# Altium project MB1219.PrjPCB (part 2 of 3)

## Sheet MotorControl.SchDoc: Motor Control
size A4; DocumentNumber: MB1219; Revision: B.1; SheetNumber: 13; SheetTotal: 17; Project: STM32F769I-EVAL
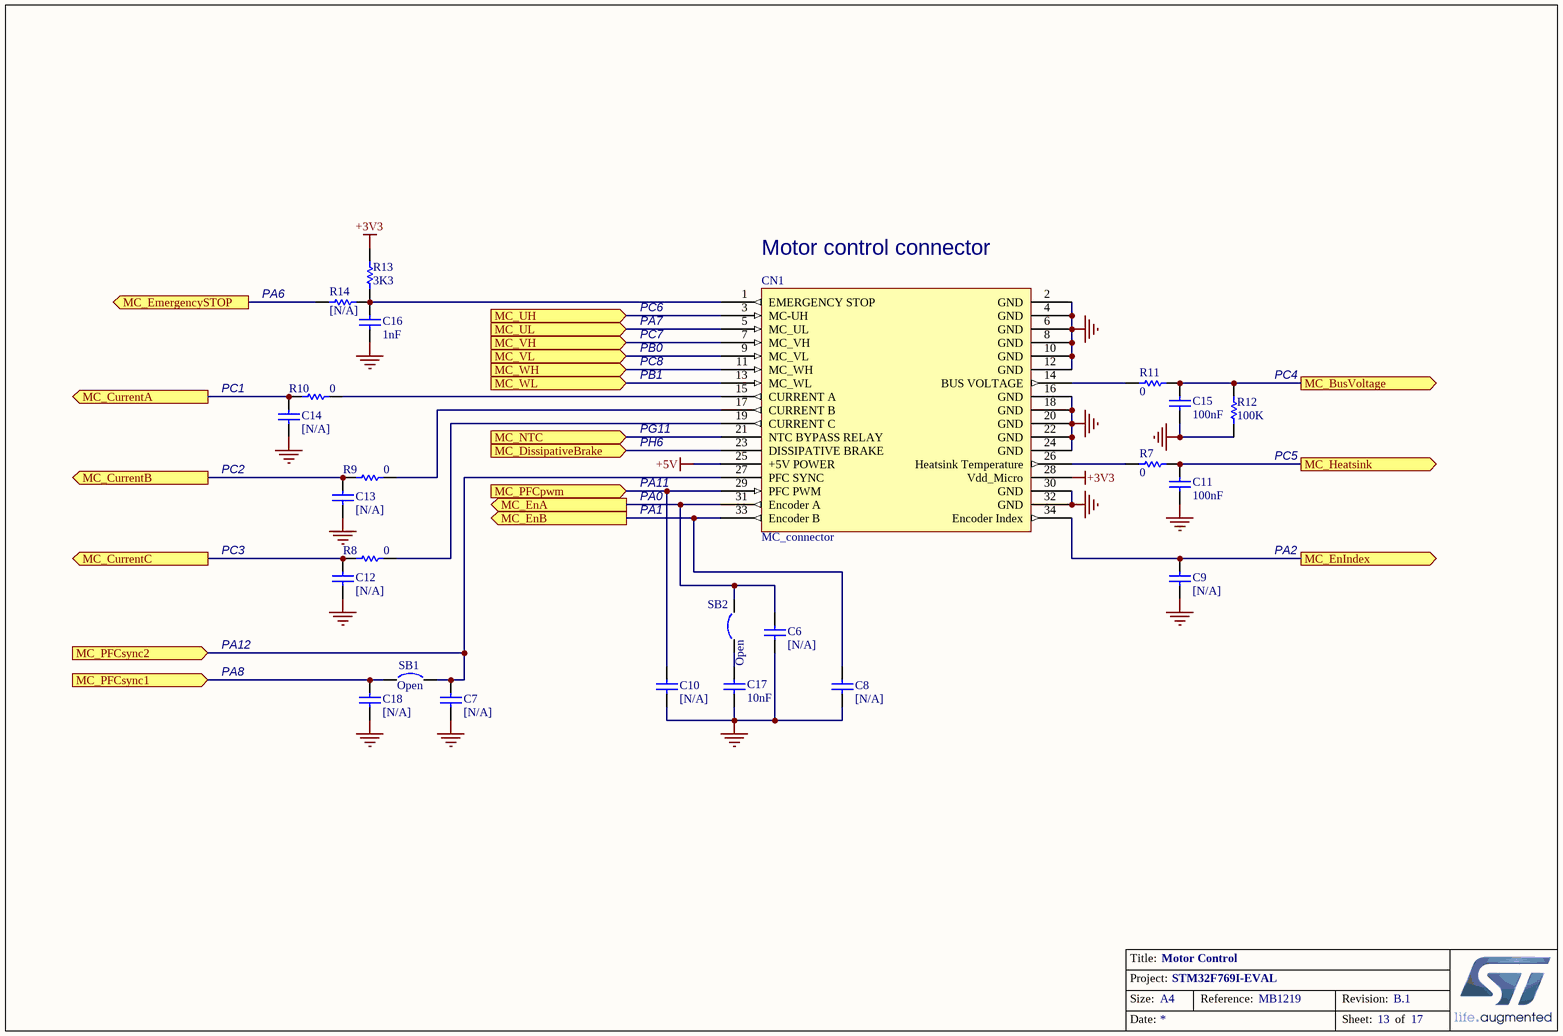
[diagram p7: MotorControl.SchDoc]

### Parts
C6  [N/A]  [0603C]
C7  [N/A]  [0603C]
C8  [N/A]  [0603C]
C9  [N/A]  [0603C]
C10  [N/A]  [0603C]
C11  100nF  [0603C]
C12  [N/A]  [0603C]
C13  [N/A]  [0603C]
C14  [N/A]  [0603C]
C15  100nF  [0603C]
C16  1nF  [0603C]
C17  10nF  [0603C]
C18  [N/A]  [0603C]
CN1  MC_connector  [IDC34S]
R7  0  [0603R]
R8  0  [0603R]
R9  0  [0603R]
R10  0  [0603R]
R11  0  [0603R]
R12  100K  [0603R]
R13  3K3  [0603R]
R14  [N/A]  [0603R]
SB1  Open  [SB_0603]
SB2  Open  [SB_0603]

### Ports
MC_BusVoltage (out), MC_CurrentA (out), MC_CurrentB (out), MC_CurrentC (out), MC_DissipativeBrake (in), MC_EmergencySTOP (out), MC_EnA (out), MC_EnB (out), MC_EnIndex (out), MC_Heatsink (out), MC_NTC (in), MC_PFCpwm (in), MC_PFCsync1 (in), MC_PFCsync2 (in), MC_UH (in), MC_UL (in), MC_VH (in), MC_VL (in), MC_WH (in), MC_WL (in)

### Nets
+3V3: CN1.28(Vdd_Micro) R13.2
+5V: CN1.25(+5V_POWER)
GND: C6.1 C7.1 C8.1 C9.1 C10.1 C11.2 C12.1 C13.1 C14.1 C15.2 C16.1 C17.2 C18.1 CN1.2(GND) CN1.4(GND) CN1.6(GND) CN1.8(GND) CN1.10(GND) CN1.12(GND) CN1.16(GND) CN1.18(GND) CN1.20(GND) CN1.22(GND) CN1.24(GND) CN1.30(GND) CN1.32(GND) R12.2
LCD_G2: R14.2 ; port MC_EmergencySTOP
PAR_D1: CN1.7(MC_VH) ; port MC_VH
NetC6_2: C6.2 CN1.31(Encoder_A) SB2.2 ; port MC_EnA
NetC7_2: C7.2 CN1.27(PFC_SYNC) SB1.2 ; port MC_PFCsync2
NetC8_2: C8.2 CN1.33(Encoder_B) ; port MC_EnB
NetC9_2: C9.2 CN1.34(Encoder_Index) ; port MC_EnIndex
NetC10_2: C10.2 CN1.29(PFC_PWM) ; port MC_PFCpwm
NetC11_1: C11.1 R7.2 ; port MC_Heatsink
NetC12_2: C12.2 R8.1 ; port MC_CurrentC
NetC13_2: C13.2 R9.1 ; port MC_CurrentB
NetC14_2: C14.2 R10.1 ; port MC_CurrentA
NetC15_1: C15.1 R11.2 R12.1 ; port MC_BusVoltage
NetC16_2: C16.2 CN1.1(EMERGENCY_STOP) R13.1 R14.1
NetC17_1: C17.1 SB2.1
NetC18_2: C18.2 SB1.1 ; port MC_PFCsync1
NetCN1_3: CN1.3(MC-UH) ; port MC_UH
NetCN1_5: CN1.5(MC_UL) ; port MC_UL
NetCN1_9: CN1.9(MC_VL) ; port MC_VL
NetCN1_11: CN1.11(MC_WH) ; port MC_WH
NetCN1_13: CN1.13(MC_WL) ; port MC_WL
NetCN1_14: CN1.14(BUS_VOLTAGE) R11.1
NetCN1_15: CN1.15(CURRENT_A) R10.2
NetCN1_17: CN1.17(CURRENT_B) R9.2
NetCN1_19: CN1.19(CURRENT_C) R8.2
NetCN1_21: CN1.21(NTC_BYPASS_RELAY) ; port MC_NTC
NetCN1_23: CN1.23(DISSIPATIVE_BRAKE) ; port MC_DissipativeBrake
NetCN1_26: CN1.26(Heatsink_Temperature) R7.1

### Notes on the sheet
- (near R14) PA6
- PC6
- (near CN1) Motor control connector
- PA7
- PB0
- PB1
- PC7
- PC8
- (near R12) PC4
- PC1
- PG11
- PH6
- PC2
- PA1
- PA0
- PA11
- (near R12) PC5
- PC3
- PA2
- PA12
- PA8
- Title:
- Project:
- Size:
- Date:
- A4
- Reference:
- Sheet:
- Revision:
- of

### Library data of the parts
C6-C10 C12-C14 C18 = cap: Capacitor; Value: 100pF; Published: 8-Jun-2000; Revision: July-2002: Re-released for DXP Platform.; Publisher: Altium Limited
C11 C15 = Cap: Capacitor; Value: 10nF; Published: 8-Jun-2000; Revision: July-2002: Re-released for DXP Platform.; Publisher: Altium Limited
C16 C17 = CAP: Capacitor; Value: 100pF; Published: 8-Jun-2000; Revision: July-2002: Re-released for DXP Platform.; Publisher: Altium Limited
R7-R11 R13 R14 = Res1: Resistor; Value: 1K; Published: 8-Jun-2000; Revision: July-2002: Re-released for DXP Platform.; Publisher: Altium Limited
R12 = res1: Resistor; Value: 1K; Published: 8-Jun-2000; Revision: July-2002: Re-released for DXP Platform.; Publisher: Altium Limited
SB1 SB2 = Circuit Breaker: Published: 24-Mar-1999; Revision: July-2002: Re-released for DXP Platform.; Publisher: Altium Limited

## Sheet Peripherals.SchDoc: Peripherals
size A4; DocumentNumber: MB1219; Revision: B.1; SheetNumber: 12; SheetTotal: 17; Project: STM32F769I-EVAL
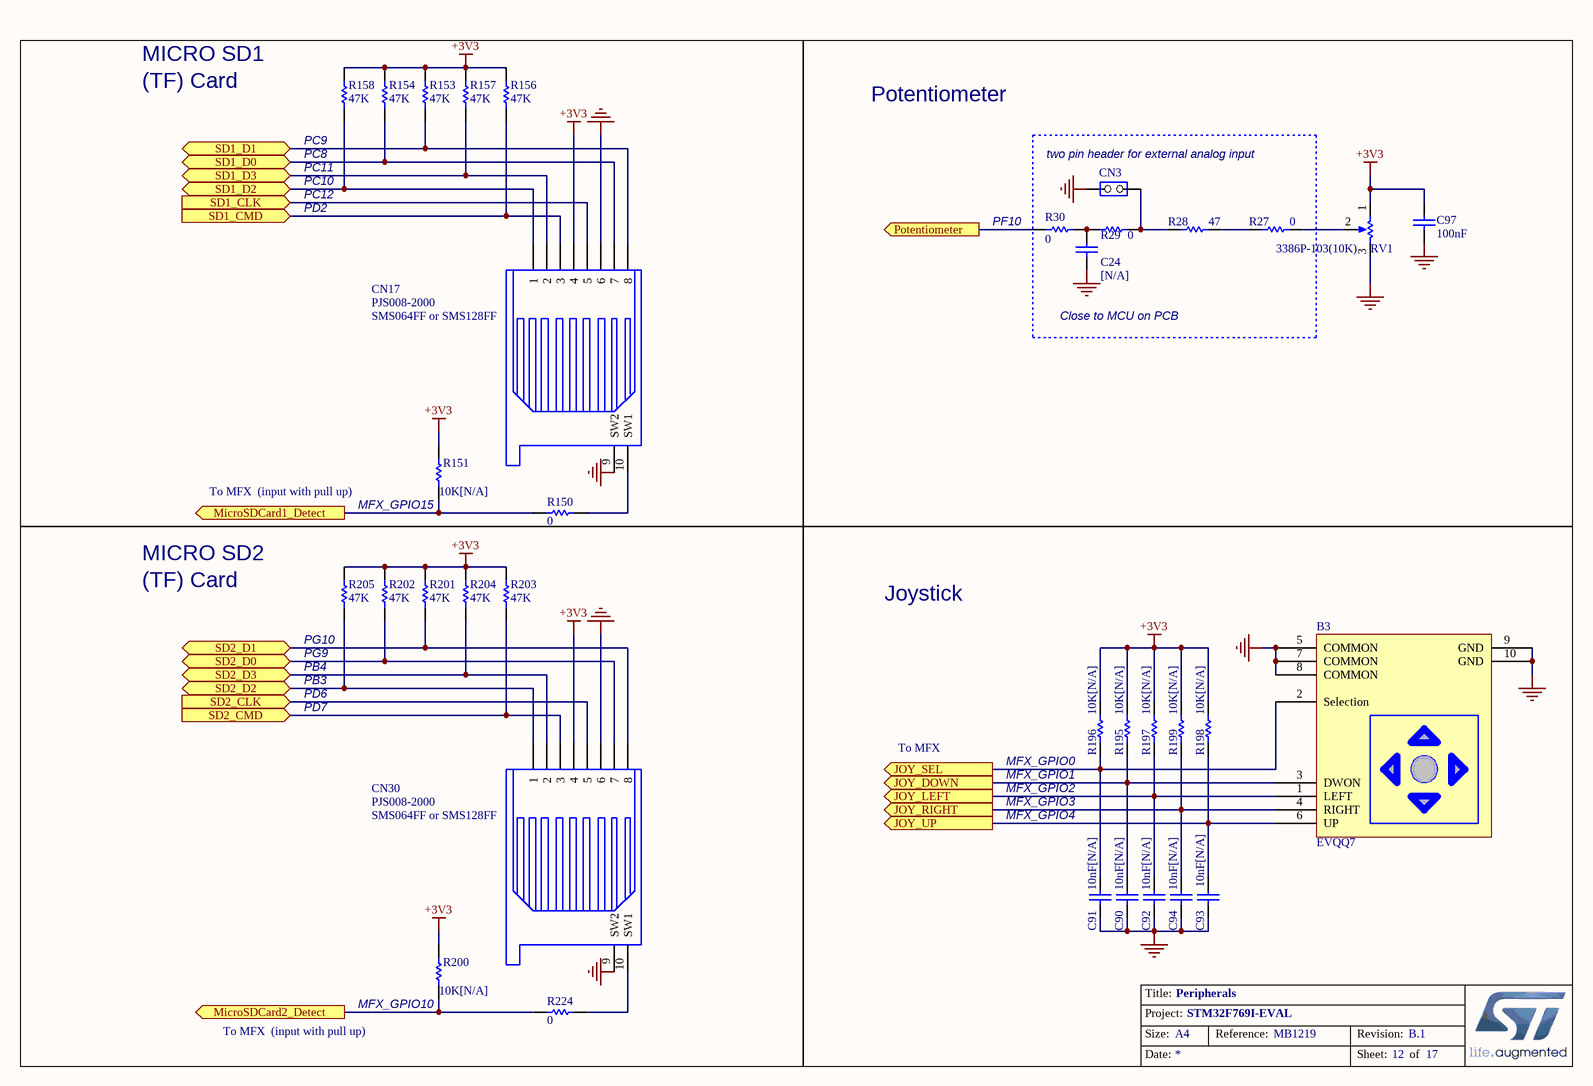
[diagram p8: Peripherals.SchDoc]

### Parts
B3  EVQQ7  [SW-JOY]
C24  [N/A]  [0603C]
C90  10nF[N/A]  [0603C]
C91  10nF[N/A]  [0603C]
C92  10nF[N/A]  [0603C]
C93  10nF[N/A]  [0603C]
C94  10nF[N/A]  [0603C]
C97  100nF  [0603C]
CN3  (no value)  [SIP2]
CN17  PJS008-2000  [MSD_PJS008_]
CN30  PJS008-2000  [MSD_PJS008_]
R27  0  [0603R]
R28  47  [0603R]
R29  0  [0603R]
R30  0  [0603R]
R150  0  [0603R]
R151  10K[N/A]  [0603R]
R153  47K  [0603R]
R154  47K  [0603R]
R156  47K  [0603R]
R157  47K  [0603R]
R158  47K  [0603R]
R195  10K[N/A]  [0603R]
R196  10K[N/A]  [0603R]
R197  10K[N/A]  [0603R]
R198  10K[N/A]  [0603R]
R199  10K[N/A]  [0603R]
R200  10K[N/A]  [0603R]
R201  47K  [0603R]
R202  47K  [0603R]
R203  47K  [0603R]
R204  47K  [0603R]
R205  47K  [0603R]
R224  0  [0603R]
RV1  3386P-103(10K)  [3386P]

### Ports
JOY_DOWN (out), JOY_LEFT (out), JOY_RIGHT (out), JOY_SEL (out), JOY_UP (out), MicroSDCard1_Detect (out), MicroSDCard2_Detect (out), Potentiometer (out), SD1_CLK (in), SD1_CMD (in), SD1_D0 (bidir), SD1_D1 (bidir), SD1_D2 (bidir), SD1_D3 (bidir), SD2_CLK (in), SD2_CMD (in), SD2_D0 (bidir), SD2_D1 (bidir), SD2_D2 (bidir), SD2_D3 (bidir)

### Nets
+3V3: C97.1 CN17.4 CN30.4 R151.2 R153.1 R154.1 R156.1 R157.1 R158.1 R195.1 R196.1 R197.1 R198.1 R199.1 R200.2 R201.1 R202.1 R203.1 R204.1 R205.1 RV1.1(BOT)
GND: B3.5(COMMON) B3.7(COMMON) B3.8(COMMON) B3.9(GND) B3.10(GND) C24.1 C90.1 C91.1 C92.1 C93.1 C94.1 C97.2 CN3.2(NO) CN17.6 CN17.9(SW2) CN30.6 CN30.9(SW2) RV1.3(TOP)
PAR_D9: CN17.5 ; port SD1_CLK
PB3: CN30.1 R205.2 ; port SD2_D2
PB4: CN30.2 R204.2 ; port SD2_D3
PD7: CN30.3 R203.2 ; port SD2_CMD
PF10: R30.2 ; port Potentiometer
PG9: CN30.7 R202.2 ; port SD2_D0
PG10: CN30.8 R201.2 ; port SD2_D1
NetB3_1: B3.1(LEFT) C92.2 R197.2 ; port JOY_LEFT
NetB3_2: B3.2(Selection) C91.2 R196.2 ; port JOY_SEL
NetB3_3: B3.3(DWON) C90.2 R195.2 ; port JOY_DOWN
NetB3_4: B3.4(RIGHT) C94.2 R199.2 ; port JOY_RIGHT
NetB3_6: B3.6(UP) C93.2 R198.2 ; port JOY_UP
NetC24_2: C24.2 R29.1 R30.1
NetCN3_1: CN3.1(COMMON) R28.1 R29.2
NetCN17_1: CN17.1 R158.2 ; port SD1_D2
NetCN17_2: CN17.2 R157.2 ; port SD1_D3
NetCN17_3: CN17.3 R156.2 ; port SD1_CMD
NetCN17_7: CN17.7 R154.2 ; port SD1_D0
NetCN17_8: CN17.8 R153.2 ; port SD1_D1
NetCN17_10: CN17.10(SW1) R150.2
NetCN30_5: CN30.5 ; port SD2_CLK
NetCN30_10: CN30.10(SW1) R224.2
NetR27_1: R27.1 R28.2
NetR27_2: R27.2 RV1.2(TAP)
NetR150_1: R150.1 R151.1 ; port MicroSDCard1_Detect
NetR200_1: R200.1 R224.1 ; port MicroSDCard2_Detect

### Notes on the sheet
- MICRO SD1
- (TF) Card
- (near R158) PC9
- Potentiometer
- (near R158) PC8
- PC10
- PC11
- PC12
- PD2
- (near CN3) two pin header for external analog input
- (near R30) PF10
- (near CN17) SMS064FF or SMS128FF
- Close to MCU on PCB
- To MFX  (input with pull up)
- (near R151) MFX_GPIO15
- MICRO SD2
- Joystick
- (near R205) PG9
- (near R205) PG10
- PB3
- PB4
- PD6
- PD7
- To MFX
- (near CN30) SMS064FF or SMS128FF
- (near R196) MFX_GPIO0
- MFX_GPIO1
- MFX_GPIO2
- MFX_GPIO3
- MFX_GPIO4
- (near R200) MFX_GPIO10
- Title:
- Project:
- Size:
- Date:
- A4
- Reference:
- Sheet:
- Revision:
- of

### Library data of the parts
C24 = cap: Capacitor; Value: 100pF; Published: 8-Jun-2000; Revision: July-2002: Re-released for DXP Platform.; Publisher: Altium Limited
C90-C94 C97 = CAP: Capacitor; Value: 100pF; Published: 8-Jun-2000; Revision: July-2002: Re-released for DXP Platform.; Publisher: Altium Limited
CN3 = JP2
CN17 CN30 = SMS016AFA5E
R27-R30 R150 R151 R200 R224 = Res1: Resistor; Value: 1K; Published: 8-Jun-2000; Revision: July-2002: Re-released for DXP Platform.; Publisher: Altium Limited
R153 R154 R156-R158 R195-R199 R201-R205 = res1: Resistor; Value: 1K; Published: 8-Jun-2000; Revision: July-2002: Re-released for DXP Platform.; Publisher: Altium Limited
RV1 = RV

## Sheet Power.SchDoc: Power
size A4; DocumentNumber: MB1219; Revision: B.1; SheetNumber: 3; SheetTotal: 17; Project: STM32F769I-EVAL
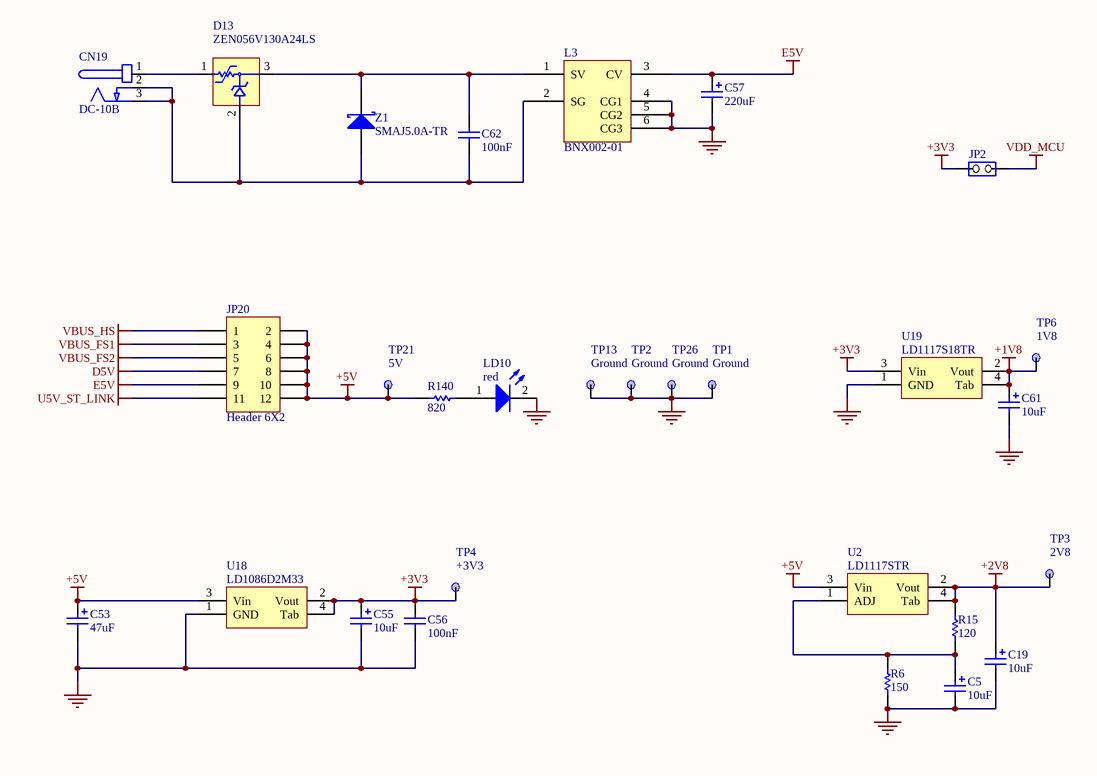
[diagram p9: Power.SchDoc]

### Parts
C5  10uF  [TAN-A]
C19  10uF  [TAN-A]
C53  47uF  [CAE_5R3X5R3_H5R4]
C55  10uF  [TAN-A]
C56  100nF  [0603C]
C57  220uF  [c310m-6]
C61  10uF  [TAN-A]
C62  100nF  [0603C]
CN19  DC-10B  [PWR_JACK_DC10]
D13  ZEN056V130A24LS  [TYCO_ZEN056V130A24LS]
JP2  (no value)  [SIP2]
JP20  Header 6X2  [HDR_2X6_2R54]
L3  BNX002-01  [BNX001]
LD10  red  [0603D]
R6  150  [0603R]
R15  120  [0603R]
R140  820  [0603R]
TP1  Ground  [TP]
TP2  Ground  [TP]
TP3  2V8  [TP]
TP4  +3V3  [TP]
TP6  1V8  [TP]
TP13  Ground  [TP]
TP21  5V  [TP]
TP26  Ground  [TP]
U2  LD1117STR  [SOT-223]
U18  LD1086D2M33  [TO263-3]
U19  LD1117S18TR  [SOT-223]
Z1  SMAJ5.0A-TR  [sma]

### Nets
+1V8: C61.1 TP6.1 U19.2(Vout) U19.4(Tab)
+2V8: C19.1 R15.1 TP3.1 U2.2(Vout) U2.4(Tab)
+3V3: C55.1 C56.1 JP2.1(COMMON) TP4.1 U18.2(Vout) U18.4(Tab) U19.3(Vin)
+5V: C53.1 JP20.2 JP20.4 JP20.6 JP20.8 JP20.10 JP20.12 R140.2 TP21.1 U2.3(Vin) U18.3(Vin)
D5V: JP20.7
E5V: C57.1 JP20.9 L3.3(CV)
GND: C5.2 C19.2 C53.2 C55.2 C56.2 C57.2 C61.2 L3.4(CG1) L3.5(CG2) L3.6(CG3) LD10.2(K) R6.2 TP1.1 TP2.1 TP13.1 TP26.1 U18.1(GND) U19.1(GND)
U5V_ST_LINK: JP20.11
VBUS_FS1: JP20.3
VBUS_FS2: JP20.5
VBUS_HS: JP20.1
VDD_MCU: JP2.2(NO)
NetC5_1: C5.1 R6.1 R15.2 U2.1(ADJ)
NetC62_1: C62.1 D13.3 L3.1(SV) Z1.2(K)
NetC62_2: C62.2 CN19.2(GND) CN19.3(GND) D13.2 L3.2(SG) Z1.1(A)
NetCN19_1: CN19.1(+) D13.1
NetLD10_1: LD10.1(A) R140.1

### Notes on the sheet
- Title:
- Project:
- Size:
- Date:
- A4
- Reference:
- Sheet:
- Revision:
- of

### Library data of the parts
C5 C19 C55 C61 = Cap Pol1: Polarized Capacitor (Radial); Published: 8-Jun-2000; Revision: July-2002: Re-released for DXP Platform.; Publisher: Altium Limited; Value: 10uF
C53 = Cap Pol1: Polarized Capacitor (Radial); Value: 10uF; Published: 8-Jun-2000; Revision: July-2002: Re-released for DXP Platform.; Publisher: Altium Limited
C56 = Cap: Capacitor; Value: 10nF; Published: 8-Jun-2000; Revision: July-2002: Re-released for DXP Platform.; Publisher: Altium Limited
C57 = Cap Pol1: Polarized Capacitor (Radial); Value: 47uF; Published: 8-Jun-2000; Revision: July-2002: Re-released for DXP Platform.; Publisher: Altium Limited
C62 = CAP: Capacitor; Value: 100pF; Published: 8-Jun-2000; Revision: July-2002: Re-released for DXP Platform.; Publisher: Altium Limited
CN19 = PJ202A
JP2 = JP2
JP20 = Header 6X2: Header, 6-Pin, Dual row; Revision: 17-Jul-2002: Re-released for DXP Platform.; Publisher: Altium Limited
L3 = BNX002
LD10 = LED2: Typical RED, GREEN, YELLOW, AMBER GaAs LED; Published: 8-Jun-2000; Revision: July-2002: Re-released for DXP Platform.; Publisher: Altium Limited
R6 R15 R140 = res1: Resistor; Value: 1K; Published: 8-Jun-2000; Revision: July-2002: Re-released for DXP Platform.; Publisher: Altium Limited
TP1-TP4 TP6 TP13 TP21 TP26 = TP
Z1 = D Schottky: Schottky Diode; Code - JEDEC: DO-214-AA; Published: 8-Jun-2000; Revision: July-2002: Re-released for DXP Platform.; Publisher: Altium Limited

## Sheet ST_LINK_V2-1.SCHDOC: ST-LINK/V2-1
size A4; DocumentNumber: MB1219; Revision: B.1; SheetNumber: 15; SheetTotal: 17; Project: STM32F769I-EVAL
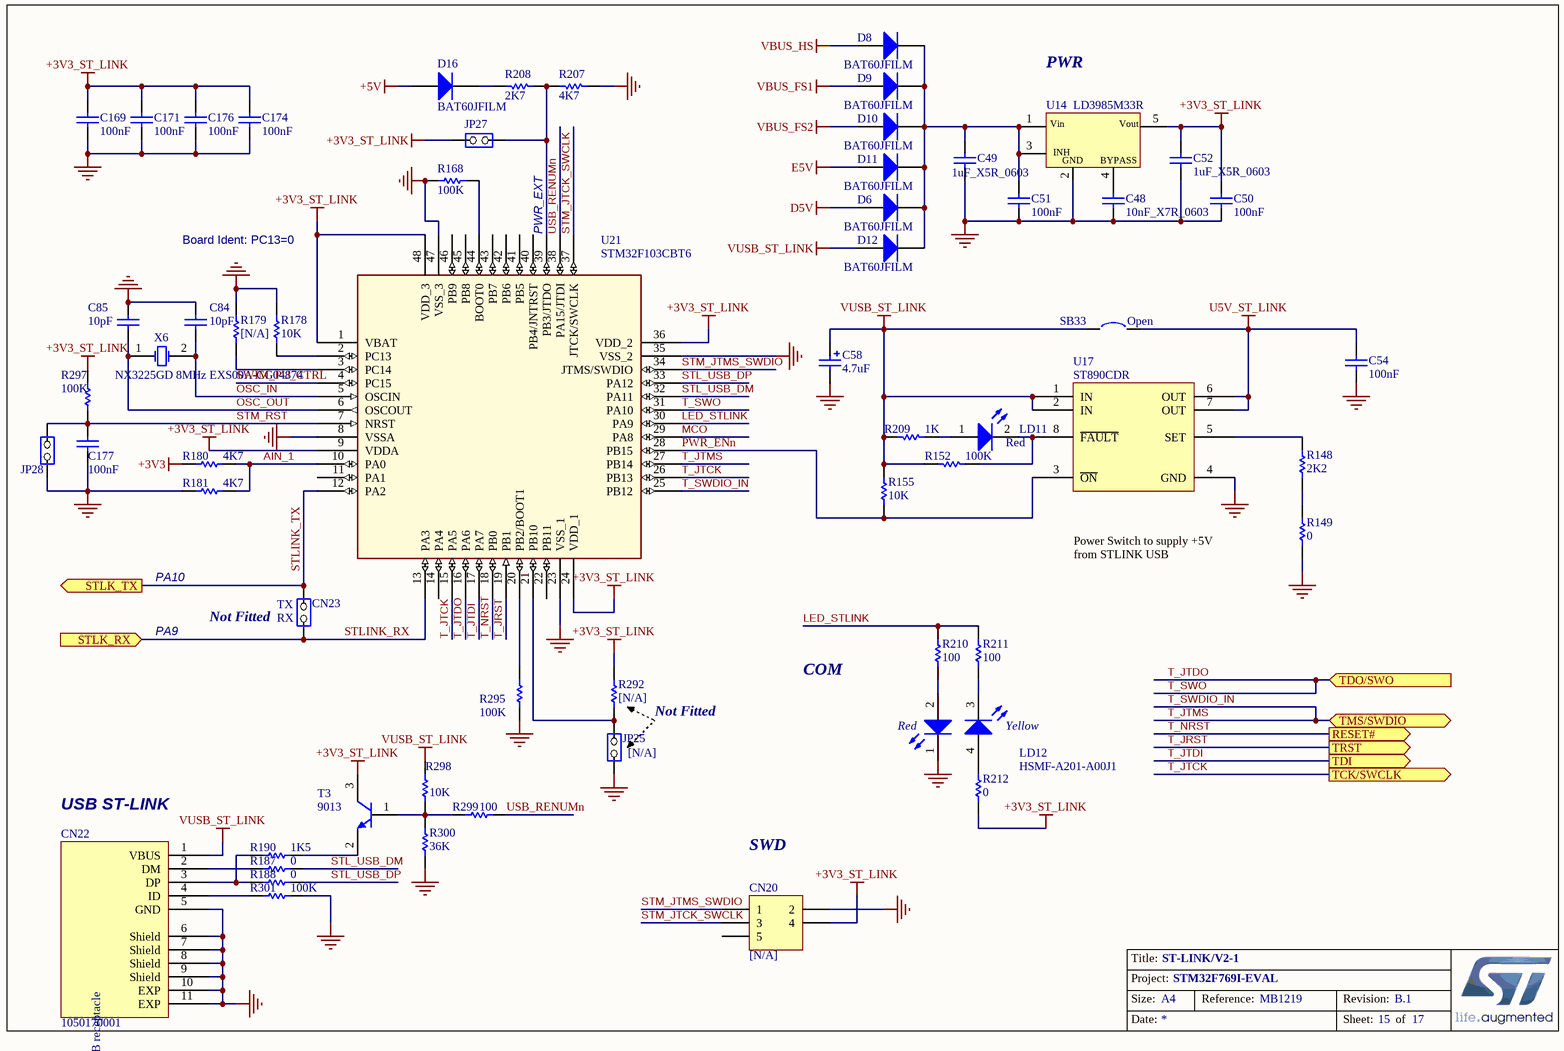
[diagram p10: ST_LINK_V2-1.SCHDOC]

### Parts
C48  10nF_X7R_0603  [0603C]
C49  1uF_X5R_0603  [0603C]
C50  100nF  [0603C]
C51  100nF  [0603C]
C52  1uF_X5R_0603  [0603C]
C54  100nF  [0603C]
C58  4.7uF  [TAN-A]
C84  10pF  [0603C]
C85  10pF  [0603C]
C169  100nF  [0603C]
C171  100nF  [0603C]
C174  100nF  [0603C]
C176  100nF  [0603C]
C177  100nF  [0603C]
CN20  [N/A]  [HDR_2X3-1_2R54-6]
CN22  1050170001  [Molex_1050170001]
CN23  (no value)  [SIP2]
D6  BAT60JFILM  [SOD-323]
D8  BAT60JFILM  [SOD-323]
D9  BAT60JFILM  [SOD-323]
D10  BAT60JFILM  [SOD-323]
D11  BAT60JFILM  [SOD-323]
D12  BAT60JFILM  [SOD-323]
D16  BAT60JFILM  [SOD-323]
JP25  [N/A]  [SIP2]
JP27  (no value)  [SIP2]
JP28  (no value)  [SIP2]
LD11  Red  [0603D]
LD12  HSMF-A201-A00J1  [LED2_3528]
R148  2K2  [0402R]
R149  0  [0603R]
R152  100K  [0603R]
R155  10K  [0402R]
R168  100K  [0603R]
R178  10K  [0603R]
R179  [N/A]  [0603R]
R180  4K7  [0603R]
R181  4K7  [0603R]
R187  0  [0603R]
R188  0  [0603R]
R190  1K5  [0603R]
R207  4K7  [0603R]
R208  2K7  [0603R]
R209  1K  [0603R]
R210  100  [0603R]
R211  100  [0603R]
R212  0  [0603R]
R292  [N/A]  [0603R]
R295  100K  [0603R]
R297  100K  [0603R]
R298  10K  [0603R]
R299  100  [0603R]
R300  36K  [0603R]
R301  100K  [0603R]
SB33  Open  [SB_0603]
T3  9013  [SOT-23]
U14  LD3985M33R  [SOT23-5]
U17  ST890CDR  [SOIC8_1R27_4R9X6]
U21  STM32F103CBT6  [LQFP48_0R5_9X9]
X6  NX3225GD 8MHz EXS00A-CG04874  [XTAL_2SM_3R2X2R5_H1]

### Ports
RESET# (out), STLK_RX (in), STLK_TX (out), TCK/SWCLK (out), TDI (out), TDO/SWO (in), TMS/SWDIO (bidir), TRST (out)

### Nets
+3V3: R180.1
+3V3_ST_LINK: C50.2 C52.1 C169.2 C171.2 C174.2 C176.2 CN20.4 JP27.1(COMMON) R212.2 R292.1 R297.2 T3.3(C) U14.5(Vout) U21.1(VBAT) U21.9(VDDA) U21.24(VDD_1) U21.36(VDD_2) U21.48(VDD_3)
+5V: D16.1(A)
D5V: D6.1(A)
E5V: D11.1(A)
GND: C48.1 C49.1 C50.1 C51.1 C52.2 C54.1 C58.2 C84.2 C85.2 C169.1 C171.1 C174.1 C176.1 C177.1 CN20.2 CN22.5(GND) CN22.6(Shield) CN22.7(Shield) CN22.8(Shield) CN22.9(Shield) CN22.10(EXP) CN22.11(EXP) JP25.1(COMMON) JP28.1(COMMON) LD12.1(RED_cathode) R149.1 R168.1 R178.1 R179.1 R181.1 R207.2 R295.1 R300.1 R301.2 U14.2(GND) U17.4(GND) U21.8(VSSA) U21.23(VSS_1) U21.35(VSS_2) U21.47(VSS_3)
U5V_ST_LINK: C54.2 SB33.2 U17.6(OUT) U17.7(OUT)
VBUS_FS1: D9.1(A)
VBUS_FS2: D10.1(A)
VBUS_HS: D8.1(A)
VUSB_ST_LINK: C58.1 CN22.1(VBUS) D12.1(A) R152.1 R155.1 R209.1 R298.2 SB33.1 U17.1(IN) U17.2(IN)
AIN_1: R180.2 R181.2 U21.10(PA0)
LED_STLINK: R210.1 R211.1 U21.30(PA9)
MCO: U21.29(PA8)
OSC_IN: C84.1 U21.5(OSCIN) X6.2(OSC2)
OSC_OUT: C85.1 U21.6(OSCOUT) X6.1(OSC1)
PWR_ENn: R155.2 U17.3(~{ON}) U21.28(PB15)
STL_USB_DM: R187.2 U21.32(PA11)
STL_USB_DP: R188.2 U21.33(PA12)
STLINK_RX: CN23.1(COMMON) U21.13(PA3) ; port STLK_RX
STLINK_TX: CN23.2(NO) U21.12(PA2) ; port STLK_TX
STM_JTCK_SWCLK: CN20.3 U21.37(JTCK/SWCLK)
STM_JTMS_SWDIO: CN20.1 U21.34(JTMS/SWDIO)
STM_RST: C177.2 JP28.2(NO) R297.1 U21.7(NRST)
SWIM_PU_CTRL: U21.4(PC15)
T_JRST: U21.19(PB1) ; port TRST
T_JTCK: U21.15(PA5) U21.26(PB13) ; port TCK/SWCLK  [project net PA14]
T_JTDI: U21.17(PA7) ; port TDI  [project net PA15]
T_JTDO: U21.16(PA6) U21.31(PA10) ; port TDO/SWO  [also labelled T_SWO]  [project net PB3]
T_JTMS: U21.25(PB12) U21.27(PB14) ; port TMS/SWDIO  [also labelled T_SWDIO_IN]  [project net PA13]
T_NRST: U21.18(PB0) ; port RESET#  [project net RESET#]
USB_RENUMn: R299.2 U21.38(PA15/JTDI)
NetC48_2: C48.2 U14.4(BYPASS)
NetC49_2: C49.2 C51.2 D6.2(K) D8.2(K) D9.2(K) D10.2(K) D11.2(K) D12.2(K) U14.1(Vin) U14.3(CE)
NetCN22_2: CN22.2(DM) R187.1
NetCN22_3: CN22.3(DP) R188.1 R190.1
NetCN22_4: CN22.4(ID) R301.1
NetD16_2: D16.2(K) R208.1
NetJP25_2: JP25.2(NO) R292.2 U21.21(PB10)
NetJP27_2: JP27.2(NO) R207.1 R208.2 U21.39(PB3/JTDO)
NetLD11_1: LD11.1(A) R209.2
NetLD11_2: LD11.2(K) R152.2 U17.8(~{FAULT})
NetLD12_2: LD12.2(Red_anode) R210.2
NetLD12_3: LD12.3(YellowGreen_cathode) R211.2
NetLD12_4: LD12.4(YellowGreen_anode) R212.1
NetR148_1: R148.1 R149.2
NetR148_2: R148.2 U17.5(SET)
NetR168_2: R168.2 U21.44(BOOT0)
NetR178_2: R178.2 U21.2(PC13)
NetR179_2: R179.2 U21.3(PC14)
NetR190_2: R190.2 T3.2(E)
NetR295_2: R295.2 U21.20(PB2/BOOT1)
NetR298_1: R298.1 R299.1 R300.2 T3.1(B)

Not connected (* = marked no-connect by the designer): CN20 5; U21 11(PA1) 14(PA4) 22(PB11) 40(PB4/JNTRST) 41(PB5) 42(PB6) 43(PB7) 45(PB8) 46(PB9)

### Notes on the sheet
- PWR
- Board Ident: PC13=0
- (near U21) PWR_EXT
- PA10
- Power Switch to supply +5V from STLINK USB
- PA9
- (near CN23) Not Fitted
- (near CN23) TX
- (near CN23) RX
- Not Fitted
- COM
- (near CN22) USB ST-LINK
- SWD
- Title:
- Project:
- Size:
- Date:
- A4
- Reference:
- Sheet:
- Revision:
- of
- (in symbol 1050170001) USB_Micro-B receptacle
- (in symbol HSMF-A201-A00J1) Red; Yellow
- (in symbol LD3985M33R) INH

### Library data of the parts
C48 = CAP SMD 0603  X7R 10000PF 50V 10%: 0603  X7R 10NF; Order code RS: 2040779; Rated voltage: 50V; Tolerance: 10%; Order code Farnell: 7569548RL; Value: 10NF; Power: *; Technology: X7R; Temperature Factor: *; Temperature Min: -55°C; Temperature Max: +125°C; STS Code: *
C49 C52 = CAP SMD 0603  X5R 1µF 25V 10%: 0603  X5R 1µF; Rated voltage: 25V; Tolerance: 10%; Manufacturer: *; Manufacturer P/N: *; Order code Farnell: 1288202RL; Value: 1µF; Power: *; Technology: X5R; Temperature  Factor: *; Temperature Max: +125°C; Temperature Min: -55°C; STS Code: *
C50 C51 C54 C169 C171 C174 C176 C177 = Capacitor_ST: Capacitor 0402 / 0603 / 0805; Revision: July-2002: Re-released for DXP Platform.; Value: 100nF
C58 = Cap Pol1: Polarized Capacitor (Radial); Value: 100pF; Ordered by: Subcon; Published: 8-Jun-2000; Revision: July-2002: Re-released for DXP Platform.; Publisher: Altium Limited
C84 C85 = Capacitor_ST: Capacitor 0402 / 0603 / 0805; Value: 100nF; Revision: July-2002: Re-released for DXP Platform.
CN20 = Header 3X2: Header, 3-Pin, Dual row; Revision: 17-Jul-2002: Re-released for DXP Platform.; Publisher: Altium Limited
CN22 = 1050170001: Silkscreen: USB
CN23 = JP2: Fitted: NO
D6 D8-D12 = BAT60JFILM: Manuf_1: STM; Provided: ST; ECCN_US/EU: EAR99/NEC; Revision: July-2002: Re-released for DXP Platform.; Order: BAT60JFILM; Manuf_Part_1: BAT60JFILM; Distrib: ST
D16 = Diode: Default Diode; Code - JEDEC: DO-214-AB; Ordered by: STM; ECCN_US/EU: EAR99/NEC; Published: 8-Jun-2000; Revision: July-2002: Re-released for DXP Platform.; Publisher: Altium Limited
JP25 = JP2
JP27 JP28 = JP2: Ordered by: Subcon; Silkscreen: Pwr_ext
LD11 = LED2: as LD10 on sheet Power; Published: 8-Jun-2000; Revision: July-2002: Re-released for DXP Platform.; Publisher: Altium Limited
R148 R168 R187 R188 R190 R295 R297 R299 R301 = Resistor_ST: Resistor 0402 / 0603 / 0805; Description: Resistor 0402 or 0603 or 0805; Value: 10K
R149 R207 R208 R210-R212 R292 R298 R300 = Res1: Resistor; Value: 1K; Published: 8-Jun-2000; Revision: July-2002: Re-released for DXP Platform.; Publisher: Altium Limited
R152 = Res1: Resistor; Value: 1K; Ordered by: Subcon; Published: 8-Jun-2000; Revision: July-2002: Re-released for DXP Platform.; Publisher: Altium Limited
R155 R178 = Resistor_ST: Resistor 0402 / 0603 / 0805; Description: Resistor 0402 or 0603 or 0805; Value: 10K
R179-R181 = Resistor_ST: Resistor 0402 / 0603 / 0805; Description: Resistor 0402 or 0603 or 0805; Value: 10K; Fitted: NO
R209 = Res1: Resistor; Ordered by: Subcon; Published: 8-Jun-2000; Revision: July-2002: Re-released for DXP Platform.; Publisher: Altium Limited; Value: 1K
SB33 = Circuit Breaker: Published: 24-Mar-1999; Revision: July-2002: Re-released for DXP Platform.; Publisher: Altium Limited
T3 = NPN: NPN Bipolar Transistor; Code - JEDEC: TO-226-AA; Published: 8-Jun-2000; Revision: July-2002: Re-released for DXP Platform.; Publisher: Altium Limited
U14 = LD3985M33R: Ultra low drop-low noise BiCMOS voltage, regulators low ESR capacitors compatible; Manuf_1: STM; Provided: ST; Ref St: 9176161; ECCN_US/EU: EAR99/NEC; Manuf_Part_1: LD3985M33R; Distrib: ST; Order: LD3985M33R
U21 = STM32F103CBT6: Medium-density performance line ARM-based 32-bit MCU with 64KB Flash; Manuf_Part_1: STM32F103C8T6; Manuf_1: STM; Ref St: 9175981; Provided: ST; ECCN_US/EU: 3A991A2/NEC; Footprint: QFP48 7X7; Distrib: ST; Order: STM32F103C8T6
X6 = XTAL: Crystal Oscillator; Published: 8-Jun-2000; LatestRevisionDate: 17-Jul-2002; LatestRevisionNote: Re-released for DXP Platform.; PackageReference: R38; Publisher: Altium Limited

## Sheet USB_OTG.SchDoc: USB_OTG_HS
size A4; DocumentNumber: MB1219; Revision: B.1; SheetNumber: 8; SheetTotal: 17; Project: STM32F769I-EVAL
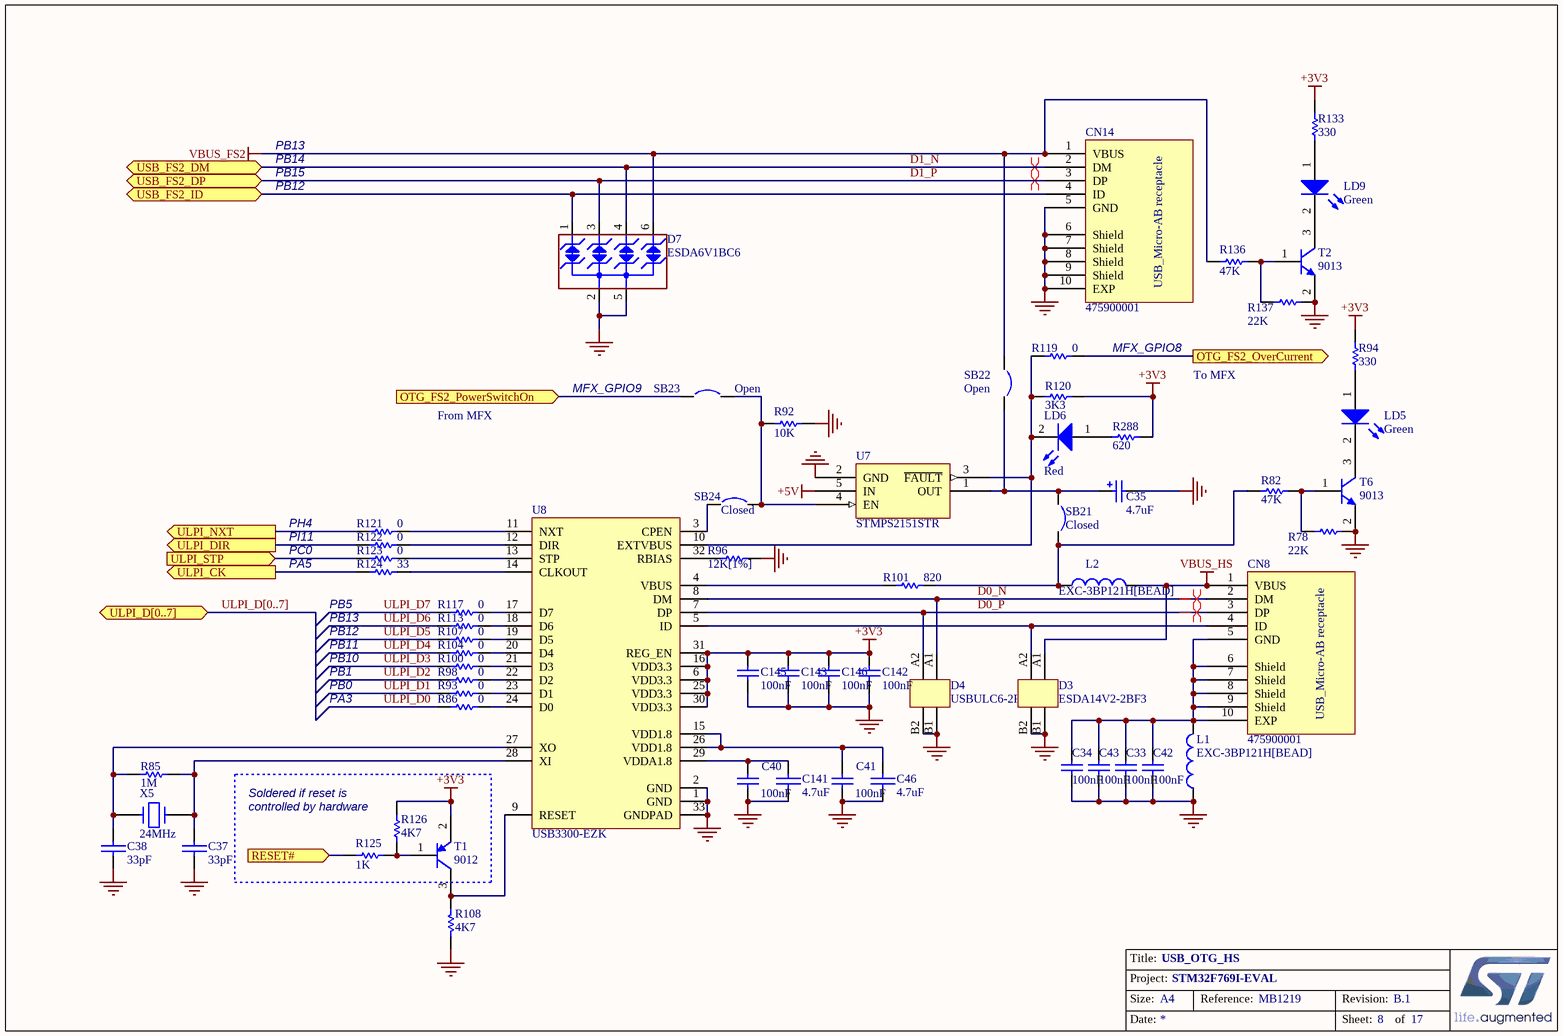
[diagram p11: USB_OTG.SchDoc]

### Parts
C33  100nF  [0603C]
C34  100nF  [0603C]
C35  4.7uF  [TAN-A]
C37  33pF  [0603C]
C38  33pF  [0603C]
C40  100nF  [0603C]
C41  100nF  [0603C]
C42  100nF  [0603C]
C43  100nF  [0603C]
C46  4.7uF  [TAN-A]
C141  4.7uF  [TAN-A]
C142  100nF  [0603C]
C143  100nF  [0603C]
C145  100nF  [0603C]
C146  100nF  [0603C]
CN8  475900001  [MOLEX_47590001]
CN14  475900001  [MOLEX_47590001]
D3  ESDA14V2-2BF3  [BGA4_0R4_0R8X0R8]
D4  USBULC6-2F3  [BGA4_0R4_1X1]
D7  ESDA6V1BC6  [SOT23-6]
L1  EXC-3BP121H[BEAD]  [0603L]
L2  EXC-3BP121H[BEAD]  [0603L]
LD5  Green  [0603D]
LD6  Red  [0603D]
LD9  Green  [0603D]
R78  22K  [0603R]
R82  47K  [0603R]
R85  1M  [0603R]
R86  0  [0603R]
R92  10K  [0603R]
R93  0  [0603R]
R94  330  [0603R]
R96  12K[1%]  [0603R]
R98  0  [0603R]
R100  0  [0603R]
R101  820  [0603R]
R104  0  [0603R]
R107  0  [0603R]
R108  4K7  [0603R]
R113  0  [0603R]
R117  0  [0603R]
R119  0  [0603R]
R120  3K3  [0603R]
R121  0  [0603R]
R122  0  [0603R]
R123  0  [0603R]
R124  33  [0603R]
R125  1K  [0603R]
R126  4K7  [0603R]
R133  330  [0603R]
R136  47K  [0603R]
R137  22K  [0603R]
R288  620  [0603R]
SB21  Closed  [SB_0603]
SB22  Open  [SB_0603]
SB23  Open  [SB_0603]
SB24  Closed  [SB_0603]
T1  9012  [SOT-23]
T2  9013  [SOT-23]
T6  9013  [SOT-23]
U7  STMPS2151STR  [SOT23-5]
U8  USB3300-EZK  [QFN32_0R5_5X5]
X5  24MHz  [XTAL1]

### Ports
OTG_FS2_OverCurrent (out), OTG_FS2_PowerSwitchOn (in), RESET# (in), ULPI_CK (out), ULPI_D[0..7] (bidir), ULPI_DIR (out), ULPI_NXT (out), ULPI_STP (in), USB_FS2_DM (bidir), USB_FS2_DP (bidir), USB_FS2_ID (bidir)

### Nets
+3V3: C142.1 C143.1 C145.1 C146.1 R94.2 R120.1 R126.1 R133.2 R288.2 T1.2(E) U8.6(VDD3.3) U8.16(VDD3.3) U8.25(VDD3.3) U8.30(VDD3.3) U8.31(REG_EN)
+5V: U7.5(IN)
GND: C33.2 C34.2 C35.2 C37.2 C38.2 C40.2 C41.2 C42.2 C43.2 C46.2 C141.2 C142.2 C143.2 C145.2 C146.2 CN14.5(GND) CN14.6(Shield) CN14.7(Shield) CN14.8(Shield) CN14.9(Shield) CN14.10(EXP) D3.B1 D3.B2 D4.B1 D4.B2 D7.2(IO2) D7.5(IO4) L1.1 R78.1 R92.1 R96.1 R108.1 R137.1 T2.2(E) T6.2(E) U7.2(GND) U8.1(GND) U8.2(GND) U8.33(GNDPAD)
VBUS_FS2: CN14.1(VBUS) D7.6(NC) R136.1 SB22.1
VBUS_HS: CN8.1(VBUS) D3.A1 L2.2
D0_N: CN8.2(DM) D4.A1 U8.8(DM)
D0_P: CN8.3(DP) D4.A2 U8.7(DP)
D1_N: CN14.2(DM) D7.4(IO3) ; port USB_FS2_DM
D1_P: CN14.3(DP) D7.3(GND) ; port USB_FS2_DP
LCD_G6: R122.2 ; port ULPI_DIR
PA5: R124.2 ; port ULPI_CK
PC0: R123.2 ; port ULPI_STP
PH4: R121.2 ; port ULPI_NXT
RESET#: R125.2 ; port RESET#
ULPI_D0: R86.2  [project net PA3]
ULPI_D1: R93.2  [project net PB0]
ULPI_D2: R98.2  [project net PB1]
ULPI_D3: R100.2  [project net PB10]
ULPI_D4: R104.2  [project net PB11]
ULPI_D5: R107.2  [project net PB12]
ULPI_D6: R113.2  [project net PB13]
ULPI_D7: R117.2  [project net PB5]
NetC33_1: C33.1 C34.1 C42.1 C43.1 CN8.5(GND) CN8.6(Shield) CN8.7(Shield) CN8.8(Shield) CN8.9(Shield) CN8.10(EXP) L1.2
NetC35_1: C35.1 SB21.1 SB22.2 U7.1(OUT)
NetC37_1: C37.1 R85.2 U8.28(XI) X5.1
NetC38_1: C38.1 R85.1 U8.27(XO) X5.2
NetC40_1: C40.1 C141.1 U8.29(VDDA1.8)
NetC41_1: C41.1 C46.1 U8.15(VDD1.8) U8.26(VDD1.8)
NetCN8_4: CN8.4(ID) D3.A2 U8.5(ID)
NetCN14_4: CN14.4(ID) D7.1(IO1) ; port USB_FS2_ID
NetL2_1: L2.1 R82.2 R101.2 SB21.2
NetLD5_1: LD5.1(A) R94.1
NetLD5_2: LD5.2(K) T6.3(C)
NetLD6_1: LD6.1(A) R288.1
NetLD6_2: LD6.2(K) R119.2 R120.2 U7.3(~{FAULT}) U8.10(EXTVBUS)
NetLD9_1: LD9.1(A) R133.1
NetLD9_2: LD9.2(K) T2.3(C)
NetR78_2: R78.2 R82.1 T6.1(B)
NetR86_1: R86.1 U8.24(D0)
NetR92_2: R92.2 SB23.2 SB24.2 U7.4(EN)
NetR93_1: R93.1 U8.23(D1)
NetR96_2: R96.2 U8.32(RBIAS)
NetR98_1: R98.1 U8.22(D2)
NetR100_1: R100.1 U8.21(D3)
NetR101_1: R101.1 U8.4(VBUS)
NetR104_1: R104.1 U8.20(D4)
NetR107_1: R107.1 U8.19(D5)
NetR108_2: R108.2 T1.3(C) U8.9(RESET)
NetR113_1: R113.1 U8.18(D6)
NetR117_1: R117.1 U8.17(D7)
NetR119_1: R119.1 ; port OTG_FS2_OverCurrent
NetR121_1: R121.1 U8.11(NXT)
NetR122_1: R122.1 U8.12(DIR)
NetR123_1: R123.1 U8.13(STP)
NetR124_1: R124.1 U8.14(CLKOUT)
NetR125_1: R125.1 R126.2 T1.1(B)
NetR136_2: R136.2 R137.2 T2.1(B)
NetSB23_1: SB23.1 ; port OTG_FS2_PowerSwitchOn
NetSB24_1: SB24.1 U8.3(CPEN)

### Buses and harness runs
bus ULPI_D[0..7] = port ULPI_D[0..7]

### Layout directives
differential pair: D0_N, D0_P, D1_N, D1_P

### Notes on the sheet
- PB13
- PB14
- PB15
- PB12
- MFX_GPIO8
- To MFX
- From MFX
- MFX_GPIO9
- PH4
- PI11
- PC0
- PA5
- PB11
- PB5
- PA3
- PB0
- PB1
- PB10
- (near R126) Soldered if reset is
- (near R126) controlled by hardware
- Title:
- Project:
- Size:
- Date:
- A4
- Reference:
- Sheet:
- Revision:
- of
- (in symbol 475900001) USB_Micro-AB receptacle

### Library data of the parts
C33 C34 C40-C43 C142 C143 C145 C146 = Cap: Capacitor; Value: 10nF; Published: 8-Jun-2000; Revision: July-2002: Re-released for DXP Platform.; Publisher: Altium Limited
C35 = Cap Pol1: as C57 on sheet Power; Published: 8-Jun-2000; Revision: July-2002: Re-released for DXP Platform.; Publisher: Altium Limited
C37 C38 C46 C141 = CAP: Capacitor
D7 = ESDA6V1BC6: 4-line ESD protection; Manuf_1: STM; Manuf_Part_1: ESDA5V3L; Description: Dual Transil array for ESD protection; Ref St: 9179034; Provided: ST; ECCN_US/EU: EAR99/NEC; Distrib: ST; Order: ESDA5V3L; Ordered by: STM
L1 L2 = Inductor: Value: 100uH; Published: 8-Jun-2000; Revision: July-2002: Re-released for DXP Platform.; Publisher: Altium Limited
LD5 LD6 LD9 = LED2: as LD10 on sheet Power; Published: 8-Jun-2000; Revision: July-2002: Re-released for DXP Platform.; Publisher: Altium Limited
R78 R82 R92 R94 R101 R120 R133 R136 R137 = res1: Resistor; Value: 1K; Published: 8-Jun-2000; Revision: July-2002: Re-released for DXP Platform.; Publisher: Altium Limited
R85 R86 R93 R96 R98 R100 R104 R107 R108 R113 R117 R119 R121-R124 R126 R288 = Res1: Resistor; Value: 1K; Published: 8-Jun-2000; Revision: July-2002: Re-released for DXP Platform.; Publisher: Altium Limited
R125 = Res1: Resistor; Published: 8-Jun-2000; Revision: July-2002: Re-released for DXP Platform.; Publisher: Altium Limited; Value: 1K
SB21 SB24 = Circuit Breaker_close: Circuit Breaker; Published: 24-Mar-1999; Revision: July-2002: Re-released for DXP Platform.; Publisher: Altium Limited
SB22 SB23 = Circuit Breaker: Published: 24-Mar-1999; Revision: July-2002: Re-released for DXP Platform.; Publisher: Altium Limited
T1 = PNP: PNP Bipolar Transistor; Published: 8-Jun-2000; Revision: July-2002: Re-released for DXP Platform.; Publisher: Altium Limited; Code - JEDEC: SOT-23
T2 T6 = NPN: as T3 on sheet ST_LINK_V2-1; Published: 8-Jun-2000; Revision: July-2002: Re-released for DXP Platform.; Publisher: Altium Limited
U7 = STMPS2141STR
X5 = CRYSTAL

## Sheet USB_OTG_FS.SchDoc: USB_OTG_FS
size A4; DocumentNumber: MB1219; Revision: B.1; SheetNumber: 9; SheetTotal: 17; Project: STM32F769I-EVAL
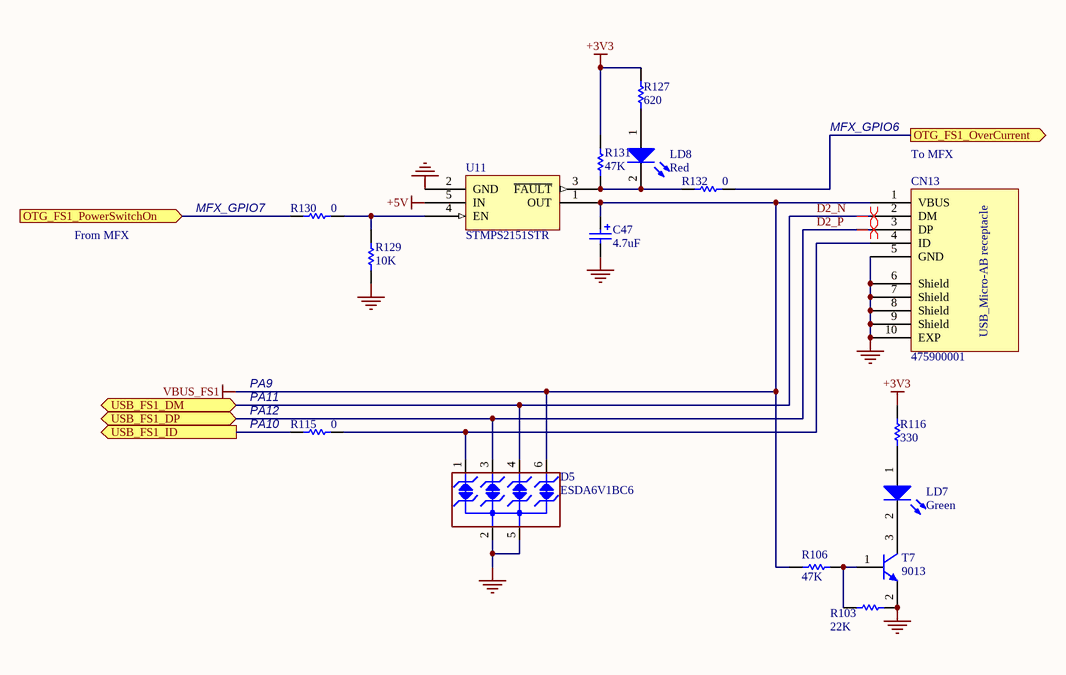
[diagram p12: USB_OTG_FS.SchDoc]

### Parts
C47  4.7uF  [TAN-A]
CN13  475900001  [MOLEX_47590001]
D5  ESDA6V1BC6  [SOT23-6]
LD7  Green  [0603D]
LD8  Red  [0603D]
R103  22K  [0603R]
R106  47K  [0603R]
R115  0  [0603R]
R116  330  [0603R]
R127  620  [0603R]
R129  10K  [0603R]
R130  0  [0603R]
R131  47K  [0603R]
R132  0  [0603R]
T7  9013  [SOT-23]
U11  STMPS2151STR  [SOT23-5]

### Ports
OTG_FS1_OverCurrent (out), OTG_FS1_PowerSwitchOn (in), USB_FS1_DM (bidir), USB_FS1_DP (bidir), USB_FS1_ID (out)

### Nets
+3V3: R116.2 R127.2 R131.1
+5V: U11.5(IN)
GND: C47.2 CN13.5(GND) CN13.6(Shield) CN13.7(Shield) CN13.8(Shield) CN13.9(Shield) CN13.10(EXP) D5.2(IO2) D5.5(IO4) R103.1 R129.1 T7.2(E) U11.2(GND)
VBUS_FS1: C47.1 CN13.1(VBUS) D5.6(NC) R106.1 U11.1(OUT)
D2_N: CN13.2(DM) D5.4(IO3) ; port USB_FS1_DM
D2_P: CN13.3(DP) D5.3(GND) ; port USB_FS1_DP
PA10: R115.2 ; port USB_FS1_ID
NetCN13_4: CN13.4(ID) D5.1(IO1) R115.1
NetLD7_1: LD7.1(A) R116.1
NetLD7_2: LD7.2(K) T7.3(C)
NetLD8_1: LD8.1(A) R127.1
NetLD8_2: LD8.2(K) R131.2 R132.2 U11.3(~{FAULT})
NetR103_2: R103.2 R106.2 T7.1(B)
NetR129_2: R129.2 R130.1 U11.4(EN)
NetR130_2: R130.2 ; port OTG_FS1_PowerSwitchOn
NetR132_1: R132.1 ; port OTG_FS1_OverCurrent

### Layout directives
differential pair: D2_N, D2_P

### Notes on the sheet
- MFX_GPIO6
- (near R130) MFX_GPIO7
- (near CN13) To MFX
- From MFX
- PA9
- (near R115) PA11
- (near R115) PA12
- (near R115) PA10
- Title:
- Project:
- Size:
- Date:
- A4
- Reference:
- Sheet:
- Revision:
- of
- (in symbol 475900001) USB_Micro-AB receptacle

### Library data of the parts
C47 = Cap Pol1: as C57 on sheet Power; Published: 8-Jun-2000; Revision: July-2002: Re-released for DXP Platform.; Publisher: Altium Limited
D5 = ESDA6V1BC6: as D7 on sheet USB_OTG; Distrib: ST; Order: ESDA5V3L; Ordered by: STM
LD7 LD8 = LED2: as LD10 on sheet Power; Published: 8-Jun-2000; Revision: July-2002: Re-released for DXP Platform.; Publisher: Altium Limited
R103 R106 R116 R131 = res1: Resistor; Value: 1K; Published: 8-Jun-2000; Revision: July-2002: Re-released for DXP Platform.; Publisher: Altium Limited
R115 R127 R129 R130 R132 = Res1: Resistor; Value: 1K; Published: 8-Jun-2000; Revision: July-2002: Re-released for DXP Platform.; Publisher: Altium Limited
T7 = NPN: as T3 on sheet ST_LINK_V2-1; Published: 8-Jun-2000; Revision: July-2002: Re-released for DXP Platform.; Publisher: Altium Limited
U11 = STMPS2141STR

## Sheet RS232.SchDoc: RS232
size A4; DocumentNumber: MB1219; Revision: B.1; SheetNumber: 10; SheetTotal: 17; Project: STM32F769I-EVAL
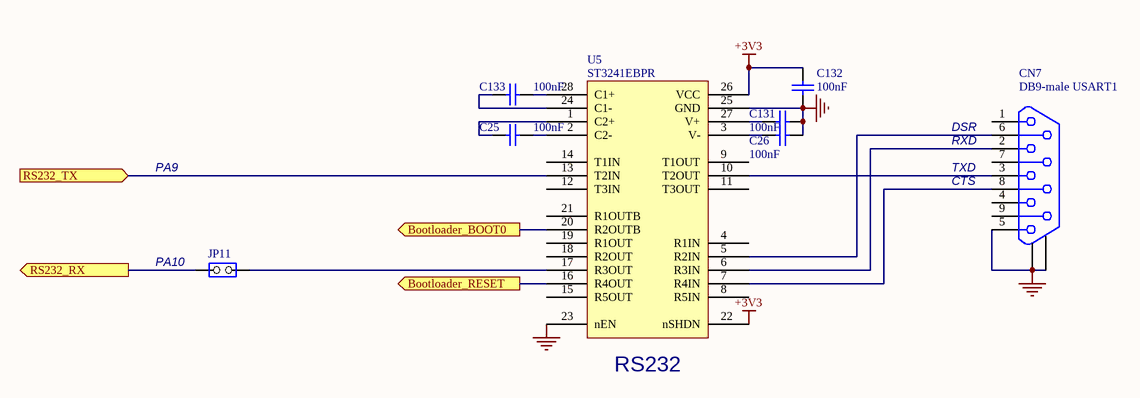
[diagram p13: RS232.SchDoc]

### Parts
C25  100nF  [0603C]
C26  100nF  [0603C]
C131  100nF  [0603C]
C132  100nF  [0603C]
C133  100nF  [0603C]
CN7  DB9-male USART1  [DB9/M]
JP11  (no value)  [SIP2]
U5  ST3241EBPR  [SSOP28_0R65_10R2X7R8]

### Ports
Bootloader_BOOT0 (out), Bootloader_RESET (out), RS232_RX (out), RS232_TX (in)

### Nets
+3V3: C132.1 U5.22(nSHDN) U5.26(VCC)
GND: C26.1 C131.1 C132.2 CN7.5 CN7.10 CN7.11 U5.23(nEN) U5.25(GND)
NetC25_1: C25.1 U5.1(C2+)
NetC25_2: C25.2 U5.2(C2-)
NetC26_2: C26.2 U5.3(V-)
NetC131_2: C131.2 U5.27(V+)
NetC133_1: C133.1 U5.24(C1-)
NetC133_2: C133.2 U5.28(C1+)
NetCN7_2: CN7.2 U5.6(R3IN)
NetCN7_3: CN7.3 U5.10(T2OUT)
NetCN7_6: CN7.6 U5.5(R2IN)
NetCN7_8: CN7.8 U5.7(R4IN)
NetD1_1: U5.20(R2OUTB) ; port Bootloader_BOOT0
NetJP5_2: U5.16(R4OUT) ; port Bootloader_RESET
NetJP11_1: JP11.1(COMMON) ; port RS232_RX
NetJP11_2: JP11.2(NO) U5.17(R3OUT)
NetJP26_1: U5.13(T2IN) ; port RS232_TX

Not connected (* = marked no-connect by the designer): CN7 1 4 7 9; U5 4(R1IN) 8(R5IN) 9(T1OUT) 11(T3OUT) 12(T3IN) 14(T1IN) 15(R5OUT) 18(R2OUT) 19(R1OUT) 21(R1OUTB)

### Notes on the sheet
- (near CN7) RXD
- (near CN7) DSR
- PA9
- (near CN7) TXD
- (near CN7) CTS
- (near JP11) PA10
- (near U5) RS232
- Title:
- Project:
- Size:
- Date:
- A4
- Reference:
- Sheet:
- Revision:
- of

### Library data of the parts
C25 C26 C131-C133 = Cap: Capacitor; Value: 10nF; Published: 8-Jun-2000; Revision: July-2002: Re-released for DXP Platform.; Publisher: Altium Limited
CN7 = DB9-USART
JP11 = JP2: Ordered by: Subcon; Silkscreen: Pwr_ext

## Sheet LCD&Camera&Connectors.SchDoc: LCD & Camera & Connector
size A4; DocumentNumber: MB1219; Revision: B.1; SheetNumber: 6; SheetTotal: 17; Project: STM32F769I-EVAL
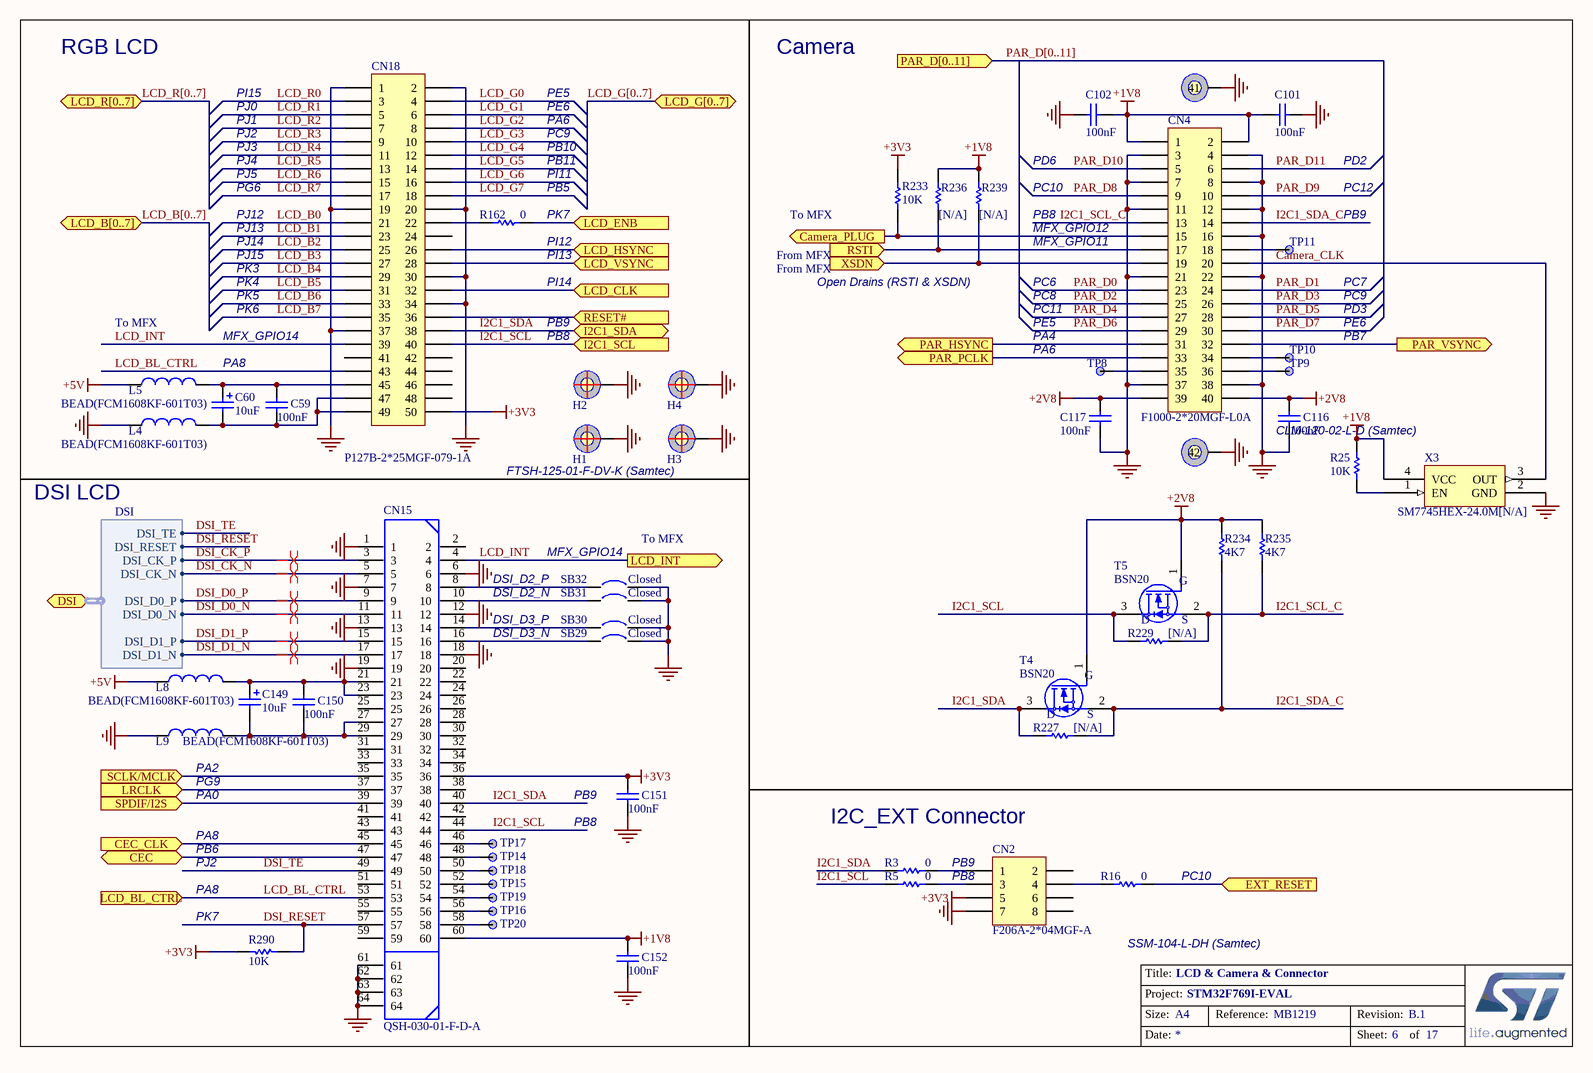
[diagram p14: LCD&Camera&Connectors.SchDoc]

### Parts
C59  100nF  [0603C]
C60  10uF  [TAN-A]
C101  100nF  [0603C]
C102  100nF  [0603C]
C116  100nF  [0603C]
C117  100nF  [0603C]
C149  10uF  [TAN-A]
C150  100nF  [0603C]
C151  100nF  [0603C]
C152  100nF  [0603C]
CN2  F206A-2*04MGF-A  [SSM-104-L-DH]
CN4  F1000-2*20MGF-L0A  [CLM-120-02-L-D]
CN15  QSH-030-01-F-D-A  [QSH-030-01-F-D-A]
CN18  P127B-2*25MGF-079-1A  [FTSH-125-01-F-DV]
H1  POSITION HOLE  [HOLE_C9D4R5]  (value not drawn)
H2  POSITION HOLE  [HOLE_C9D4R5]  (value not drawn)
H3  POSITION HOLE  [HOLE_C9D4R5]  (value not drawn)
H4  POSITION HOLE  [HOLE_C9D4R5]  (value not drawn)
L4  BEAD(FCM1608KF-601T03)  [0603L]
L5  BEAD(FCM1608KF-601T03)  [0603L]
L8  BEAD(FCM1608KF-601T03)  [0603L]
L9  BEAD(FCM1608KF-601T03)  [0603L]
R3  0  [0603R]
R5  0  [0603R]
R16  0  [0603R]
R25  10K  [0402R]
R162  0  [0603R]
R227  [N/A]  [0603R]
R229  [N/A]  [0603R]
R233  10K  [0603R]
R234  4K7  [0603R]
R235  4K7  [0603R]
R236  [N/A]  [0603R]
R239  [N/A]  [0603R]
R290  10K  [0603R]
SB29  Closed  [SB_0603]
SB30  Closed  [SB_0603]
SB31  Closed  [SB_0603]
SB32  Closed  [SB_0603]
T4  BSN20  [SOT-23]
T5  BSN20  [SOT-23]
TP8  (no value)  [TP]
TP9  (no value)  [TP]
TP10  (no value)  [TP]
TP11  (no value)  [TP]
TP14  (no value)  [TP]
TP15  (no value)  [TP]
TP16  (no value)  [TP]
TP17  (no value)  [TP]
TP18  (no value)  [TP]
TP19  (no value)  [TP]
TP20  (no value)  [TP]
X3  SM7745HEX-24.0M[N/A]  [OSC_4SM_7X5]

### Ports
Camera_PLUG (out), CEC (bidir), CEC_CLK (in), DSI (harness DSI), EXT_RESET (in), I2C1_SCL (in), I2C1_SDA (bidir), LCD_B[0..7] (bidir), LCD_BL_CTRL (in), LCD_CLK (in), LCD_ENB (in), LCD_G[0..7] (bidir), LCD_HSYNC (in), LCD_INT (out), LCD_R[0..7] (bidir), LCD_VSYNC (in), LRCLK (in), PAR_D[0..11] (in), PAR_HSYNC (out), PAR_PCLK (out), PAR_VSYNC (out), RESET# (in), RSTI (in), SCLK/MCLK (in), SPDIF/I2S (in), XSDN (in)

### Harnesses
DSI: DSI_CK_P, DSI_CK_N, DSI_D0_P, DSI_D0_N, DSI_D1_P, DSI_D1_N, DSI_TE, DSI_RESET

### Nets
+1V8: C101.1 C102.2 C152.1 CN4.1 CN4.2 CN15.60 R25.2 R236.2 R239.2 X3.4(VCC)
+2V8: C116.1 C117.1 CN4.39 CN4.40 R234.2 R235.2 T4.1(G) T5.1(G)
+3V3: C151.1 CN2.5 CN15.36 CN18.50 R233.1 R290.2
+5V: L5.1 L8.1
GND: C101.2 C102.1 C116.2 C117.2 C151.2 C152.2 CN2.7 CN4.3 CN4.4 CN4.7 CN4.8 CN4.11 CN4.12 CN4.16 CN4.21 CN4.22 CN4.37 CN4.38 CN4.41 CN4.42 CN15.1 CN15.6 CN15.7 CN15.12 CN15.13 CN15.18 CN15.19 CN15.61 CN15.62 CN15.63 CN15.64 CN18.1 CN18.2 CN18.19 CN18.20 CN18.30 CN18.34 CN18.37 H1.1 H2.1 H3.1 H4.1 L4.1 L9.1 SB29.2 SB30.2 SB31.2 SB32.2 X3.2(GND)
Camera_CLK: CN4.20 X3.3(OUT)
DSI_CK_N: CN15.5 ; port DSI.DSI_CK_N
DSI_CK_P: CN15.3 ; port DSI.DSI_CK_P
DSI_D0_N: CN15.11 ; port DSI.DSI_D0_N
DSI_D0_P: CN15.9 ; port DSI.DSI_D0_P
DSI_D1_N: CN15.17 ; port DSI.DSI_D1_N
DSI_D1_P: CN15.15 ; port DSI.DSI_D1_P
DSI_RESET: CN15.57 R162.2 R290.1 ; port LCD_ENB, port DSI.DSI_RESET
DSI_TE: CN15.49 CN18.9 ; port DSI.DSI_TE  [also labelled LCD_R3]
I2C1_SCL: CN15.44 CN18.40 R5.1 R229.1 T5.3(D) ; port I2C1_SCL
I2C1_SCL_C: CN4.13 R229.2 R235.1 T5.2(S)
I2C1_SDA: CN15.40 CN18.38 R3.1 R227.1 T4.3(D) ; port I2C1_SDA
I2C1_SDA_C: CN4.14 R227.2 R234.1 T4.2(S)
LCD_B0: CN18.21
LCD_B1: CN18.23
LCD_B2: CN18.25
LCD_B3: CN18.27
LCD_B4: CN18.29
LCD_B5: CN18.31
LCD_B6: CN18.33
LCD_B7: CN18.35
LCD_BL_CTRL: CN15.53 CN18.43 ; port LCD_BL_CTRL
LCD_G0: CN18.4
LCD_G1: CN18.6
LCD_G2: CN18.8
LCD_G3: CN4.26 CN18.10  [also labelled PAR_D3]
LCD_G4: CN18.12
LCD_G5: CN18.14
LCD_G6: CN18.16
LCD_G7: CN18.18
LCD_INT: CN15.4 CN18.39 ; port LCD_INT
LCD_R0: CN18.3
LCD_R1: CN18.5
LCD_R2: CN18.7
LCD_R4: CN18.11
LCD_R5: CN18.13
LCD_R6: CN18.15
LCD_R7: CN18.17
PA4: CN4.31 ; port PAR_HSYNC
PAR_D0: CN4.23
PAR_D1: CN4.24
PAR_D2: CN4.25
PAR_D4: CN4.27
PAR_D5: CN4.28
PAR_D6: CN4.29
PAR_D7: CN4.30
PAR_D8: CN4.9 R16.2 ; port EXT_RESET
PAR_D9: CN4.10
PAR_D10: CN4.5
PAR_D11: CN4.6
PB7: CN4.32 ; port PAR_VSYNC
PG9: CN15.37 ; port LRCLK
PI12: CN18.26 ; port LCD_HSYNC
PI13: CN18.28 ; port LCD_VSYNC
PI14: CN18.32 ; port LCD_CLK
RESET#: CN18.36 ; port RESET#
NetC59_1: C59.1 C60.1 CN18.45 L5.2
NetC59_2: C59.2 C60.2 CN18.47 CN18.49 L4.2
NetC149_1: C149.1 C150.1 CN15.21 CN15.23 L8.2
NetC149_2: C149.2 C150.2 CN15.27 CN15.29 L9.2
NetCN2_1: CN2.1 R3.2
NetCN2_3: CN2.3 R5.2
NetCN2_4: CN2.4 R16.1
NetCN4_15: CN4.15 R233.2 ; port Camera_PLUG
NetCN4_17: CN4.17 R236.1 ; port RSTI
NetCN4_18: CN4.18 TP11.1
NetCN4_19: CN4.19 R239.1 ; port XSDN
NetCN4_33: CN4.33 ; port PAR_PCLK
NetCN4_34: CN4.34 TP10.1
NetCN4_35: CN4.35 TP8.1
NetCN4_36: CN4.36 TP9.1
NetCN15_8: CN15.8 SB32.1
NetCN15_10: CN15.10 SB31.1
NetCN15_14: CN15.14 SB30.1
NetCN15_16: CN15.16 SB29.1
NetCN15_35: CN15.35 ; port SCLK/MCLK
NetCN15_39: CN15.39 ; port SPDIF/I2S
NetCN15_45: CN15.45 ; port CEC_CLK
NetCN15_46: CN15.46 TP17.1
NetCN15_47: CN15.47 ; port CEC
NetCN15_48: CN15.48 TP14.1
NetCN15_50: CN15.50 TP18.1
NetCN15_52: CN15.52 TP15.1
NetCN15_54: CN15.54 TP19.1
NetCN15_56: CN15.56 TP16.1
NetCN15_58: CN15.58 TP20.1
NetCN18_22: CN18.22 R162.1
NetR25_1: R25.1 X3.1(EN)

Not connected (* = marked no-connect by the designer): CN2 2 6 8; CN15 2 20 22 24 25 26 28 30 31 32 33 34 38 41 42 43 51 55 59; CN18 24 41 42 44 46 48

### Buses and harness runs
bus LCD_B[0..7] = port LCD_B[0..7]
bus LCD_G[0..7] = port LCD_G[0..7]
bus LCD_R[0..7] = port LCD_R[0..7]
bus PAR_D[0..11] = port PAR_D[0..11]

### Layout directives
differential pair: DSI_CK_N, DSI_CK_P, DSI_D0_N, DSI_D0_P, DSI_D1_N, DSI_D1_P

### Notes on the sheet
- RGB LCD
- Camera
- PI15
- PJ0
- PJ1
- PE5
- PE6
- PA6
- PJ2
- PJ3
- PJ4
- PJ5
- PG6
- PC9
- PB10
- PB11
- (near R162) PI11
- (near R162) PB5
- PC10
- PD6
- PD2
- PC12
- PJ12
- PJ13
- PJ14
- PJ15
- (near R162) PK7
- (near R162) PI12
- (near R162) PI13
- From MFX
- To MFX
- PB8
- MFX_GPIO12
- MFX_GPIO11
- PB9
- PK3
- PK4
- PK5
- PK6
- PI14
- Open Drains (RSTI & XSDN)
- PC11
- PC6
- PC8
- PC7
- PD3
- PA8
- MFX_GPIO14
- PA4
- PB7
- (near CN4) CLM-120-02-L-D (Samtec)
- DSI LCD
- FTSH-125-01-F-DV-K (Samtec)
- DSI_D2_P
- DSI_D2_N
- DSI_D3_P
- DSI_D3_N
- PA0
- (near L9) PA2
- (near L9) PG9
- (near C151) PB9
- PB6
- (near C151) PB8
- I2C_EXT Connector
- (near R290) PK7
- (near R16) PC10
- (near CN2) SSM-104-L-DH (Samtec)
- Title:
- Project:
- Size:
- Date:
- A4
- Reference:
- Sheet:
- Revision:
- of

### Library data of the parts
C59 C101 C102 C116 C117 C150-C152 = Cap: Capacitor; Value: 10nF; Published: 8-Jun-2000; Revision: July-2002: Re-released for DXP Platform.; Publisher: Altium Limited
C60 C149 = Cap Pol1: Polarized Capacitor (Radial); Published: 8-Jun-2000; Revision: July-2002: Re-released for DXP Platform.; Publisher: Altium Limited; Value: 10uF
CN2 = SSM-104-L-DH: Header, 5-Pin, Dual row; Revision: 17-Jul-2002: Re-released for DXP Platform.; Publisher: Altium Limited
CN4 = CLM-120-02-L-D: Header, 20-Pin, Dual row; Revision: 17-Jul-2002: Re-released for DXP Platform.; Publisher: Altium Limited
CN15 = QSH-030-01-F-D-A: HIGH SPEED SOCKET STRIP, .5mm PITCH, 60 PINS; MANUFACTURER: SAMTEC; PCB DECAL: QSH-030-01-X-D-A; CREATED: 28 JAN 2014 - WENDY XIN
CN18 = Header 25X2: Header, 26-Pin, Dual row; Revision: 17-Jul-2002: Re-released for DXP Platform.; Publisher: Altium Limited
L4 L5 L8 L9 = Inductor: Value: 100uH; Published: 8-Jun-2000; Revision: July-2002: Re-released for DXP Platform.; Publisher: Altium Limited
R3 R5 R16 R25 R162 R227 R229 R233 R290 = Res1: Resistor; Value: 1K; Published: 8-Jun-2000; Revision: July-2002: Re-released for DXP Platform.; Publisher: Altium Limited
R234-R236 R239 = res1: Resistor; Value: 1K; Published: 8-Jun-2000; Revision: July-2002: Re-released for DXP Platform.; Publisher: Altium Limited
SB29-SB32 = Circuit Breaker: Published: 24-Mar-1999; Revision: July-2002: Re-released for DXP Platform.; Publisher: Altium Limited
T4 T5 = 2N7000
TP8-TP11 TP14-TP20 = TP
X3 = SM7745HEV-50.0M

## Sheet MFX & LEDs.SchDoc: MFX & LEDs
size A4; DocumentNumber: MB1219; Revision: B.1; SheetNumber: 16; SheetTotal: 17; Project: STM32F769I-EVAL
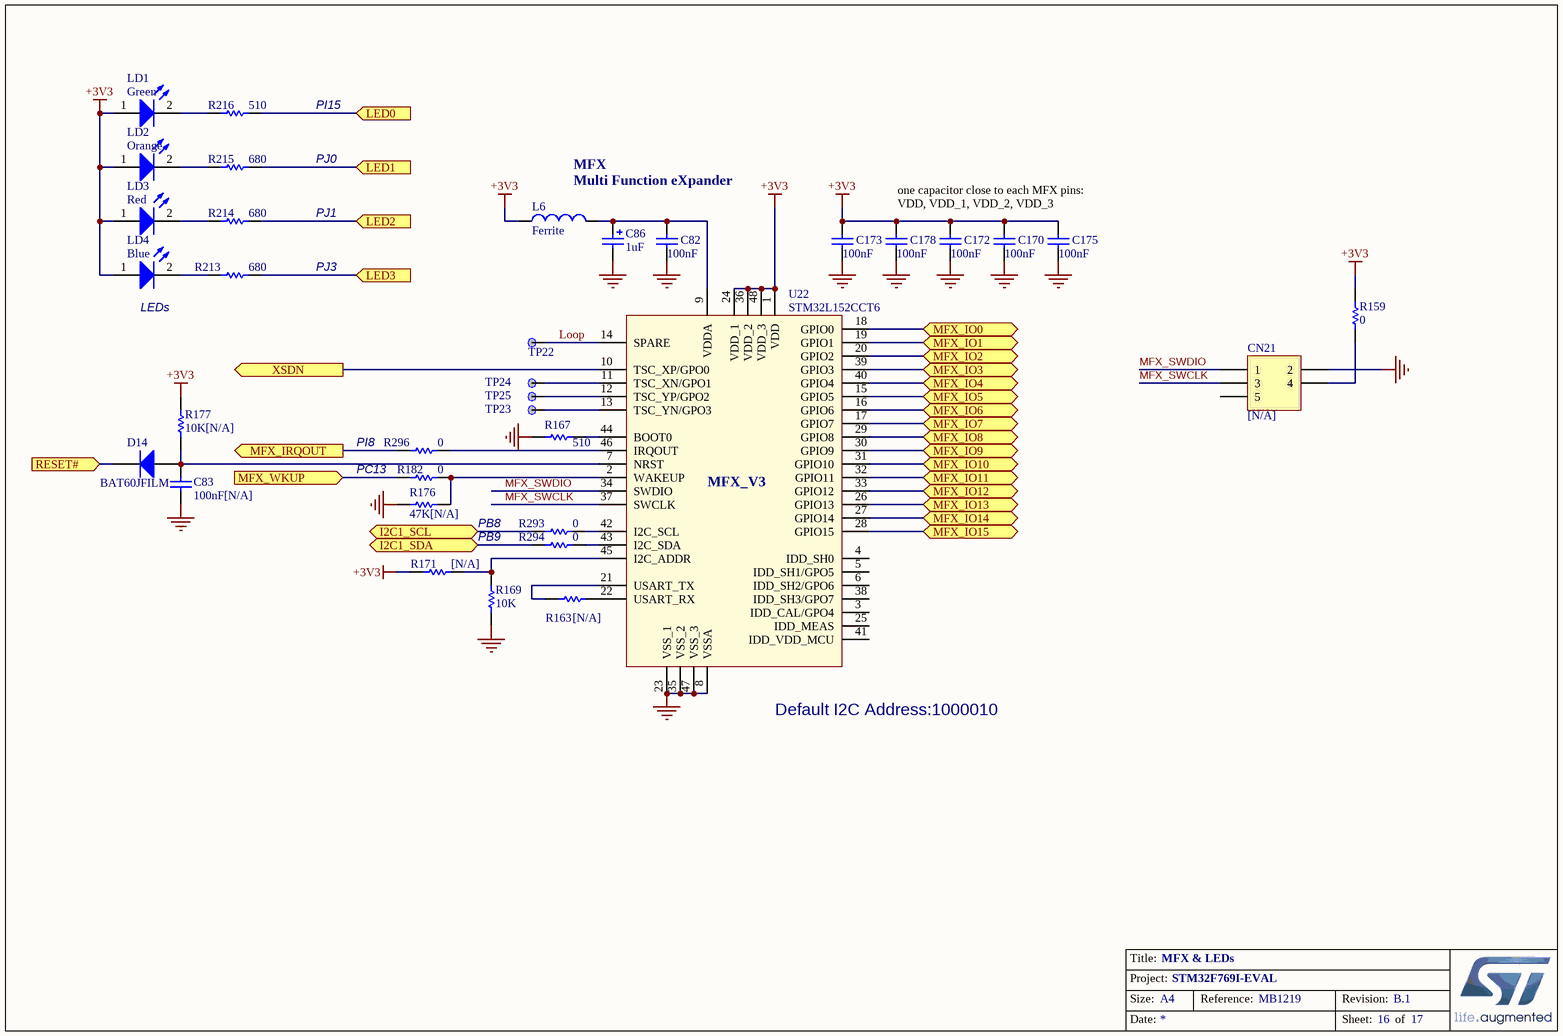
[diagram p15: MFX & LEDs.SchDoc]

### Parts
C82  100nF  [0402C]
C83  100nF[N/A]  [0402C]
C86  1uF  [TAN-A]
C170  100nF  [0402C]
C172  100nF  [0402C]
C173  100nF  [0402C]
C175  100nF  [0402C]
C178  100nF  [0402C]
CN21  [N/A]  [HDR_2X3-1_2R54-6]
D14  BAT60JFILM  [SOD-323]
L6  Ferrite  [0603L]
LD1  Green  [0603D]
LD2  Orange  [0603D]
LD3  Red  [0603D]
LD4  Blue  [0603D]
R159  0  [0603R]
R163  [N/A]  [0603R]
R167  510  [0402R]
R169  10K  [0402R]
R171  [N/A]  [0603R]
R176  47K[N/A]  [0402R]
R177  10K[N/A]  [0402R]
R182  0  [0603R]
R213  680  [0603R]
R214  680  [0603R]
R215  680  [0603R]
R216  510  [0603R]
R293  0  [0603R]
R294  0  [0603R]
R296  0  [0603R]
TP22  (no value)  [TP]
TP23  (no value)  [TP]
TP24  (no value)  [TP]
TP25  (no value)  [TP]
U22  STM32L152CCT6  [LQFP48_0R5_9X9]

### Ports
I2C1_SCL (bidir), I2C1_SDA (bidir), LED0 (in), LED1 (in), LED2 (in), LED3 (in), MFX_IO0 (bidir), MFX_IO1 (bidir), MFX_IO2 (bidir), MFX_IO3 (bidir), MFX_IO4 (bidir), MFX_IO5 (bidir), MFX_IO6 (bidir), MFX_IO7 (bidir), MFX_IO8 (bidir), MFX_IO9 (bidir), MFX_IO10 (bidir), MFX_IO11 (bidir), MFX_IO12 (bidir), MFX_IO13 (bidir), MFX_IO14 (bidir), MFX_IO15 (bidir), MFX_IRQOUT (out), MFX_WKUP (in), RESET# (in), XSDN (out)

### Nets
+3V3: C170.2 C172.1 C173.2 C175.2 C178.2 L6.1 LD1.1(A) LD2.1(A) LD3.1(A) LD4.1(A) R159.1 R171.2 R177.2 U22.1(VDD) U22.24(VDD_1) U22.36(VDD_2) U22.48(VDD_3)
GND: C82.1 C83.1 C86.2 C170.1 C172.2 C173.1 C175.1 C178.1 CN21.2 R167.2 R169.2 R176.1 U22.8(VSSA) U22.23(VSS_1) U22.35(VSS_2) U22.47(VSS_3)
I2C1_SCL: R293.1 ; port I2C1_SCL
I2C1_SDA: R294.1 ; port I2C1_SDA
LCD_INT: U22.27(GPIO14) ; port MFX_IO14
Loop: TP22.1 U22.14(SPARE)
MFX_SWCLK: CN21.3 U22.37(SWCLK)
MFX_SWDIO: CN21.1 U22.34(SWDIO)
PC13: R182.2 ; port MFX_WKUP
PI8: R296.1 ; port MFX_IRQOUT
RESET#: D14.2(K) ; port RESET#
NetB3_1: U22.20(GPIO2) ; port MFX_IO2
NetB3_2: U22.18(GPIO0) ; port MFX_IO0
NetB3_3: U22.19(GPIO1) ; port MFX_IO1
NetB3_4: U22.39(GPIO3) ; port MFX_IO3
NetB3_6: U22.40(GPIO4) ; port MFX_IO4
NetC82_2: C82.2 C86.1 L6.2 U22.9(VDDA)
NetC83_2: C83.2 D14.1(A) R177.1 U22.7(NRST)
NetCN4_15: U22.33(GPIO12) ; port MFX_IO12
NetCN4_17: U22.32(GPIO11) ; port MFX_IO11
NetCN4_19: U22.10(TSC_XP/GPO0) ; port XSDN
NetCN21_4: CN21.4 R159.2
NetLD1_2: LD1.2(K) R216.2
NetLD2_2: LD2.2(K) R215.2
NetLD3_2: LD3.2(K) R214.2
NetLD4_2: LD4.2(K) R213.2
NetR72_2: U22.26(GPIO13) ; port MFX_IO13
NetR119_1: U22.29(GPIO8) ; port MFX_IO8
NetR130_2: U22.17(GPIO7) ; port MFX_IO7
NetR132_1: U22.16(GPIO6) ; port MFX_IO6
NetR150_1: U22.28(GPIO15) ; port MFX_IO15
NetR163_1: R163.1 U22.21(USART_TX)
NetR163_2: R163.2 U22.22(USART_RX)
NetR167_1: R167.1 U22.44(BOOT0)
NetR169_1: R169.1 R171.1 U22.45(I2C_ADDR)
NetR176_2: R176.2 R182.1 U22.2(WAKEUP)
NetR200_1: U22.31(GPIO10) ; port MFX_IO10
NetR213_1: R213.1 ; port LED3
NetR214_1: R214.1 ; port LED2
NetR215_1: R215.1 ; port LED1
NetR216_1: R216.1 ; port LED0
NetR293_2: R293.2 U22.42(I2C_SCL)
NetR294_2: R294.2 U22.43(I2C_SDA)
NetR296_2: R296.2 U22.46(IRQOUT)
NetSB23_1: U22.30(GPIO9) ; port MFX_IO9
NetTP23_1: TP23.1 U22.13(TSC_YN/GPO3)
NetTP24_1: TP24.1 U22.11(TSC_XN/GPO1)
NetTP25_1: TP25.1 U22.12(TSC_YP/GPO2)
NetU20_G3: U22.15(GPIO5) ; port MFX_IO5

Not connected (* = marked no-connect by the designer): CN21 5; U22 3(IDD_CAL/GPO4) 4(IDD_SH0) 5(IDD_SH1/GPO5) 6(IDD_SH2/GPO6) 25(IDD_MEAS) 38(IDD_SH3/GPO7) 41(IDD_VDD_MCU)

### Notes on the sheet
- PI15
- PJ0
- PJ1
- MFX
  Multi Function eXpander
- one capacitor close to each MFX pins: VDD, VDD_1, VDD_2, VDD_3
- (near LD4) LEDs
- PJ3
- PI8
- PC13
- PB8
- PB9
- (near U22) Default I2C Address:1000010
- Title:
- Project:
- Size:
- Date:
- A4
- Reference:
- Sheet:
- Revision:
- of
- (in symbol MFX) MFX_V3

### Library data of the parts
C82 C83 C170 C172 C173 C175 C178 = Cap_100nF_X7R_10%_0402: Capacitor,100nF,16V,X7R,10%,0402,YAGEO; Manuf_Part_1: CC0402KRX7R7BB104; Revision: July-2002: Re-released for DXP Platform.; Value: 100nF; Order: CC0402KRX7R7BB104; Manuf_1: YAGEO
C86 = Cap_1uF_POL_10%_TANA: Polarized Capacitor,1uF,16V,10%,typeA,AVX; Manuf_Part_1: TAJA105K016R; Revision: July-2002: Re-released for DXP Platform.; Value: 1uF; Order: TAJA105K016R; Manuf_1: AVX; Distrib: *
CN21 = Header 3X2: Header, 3-Pin, Dual row; Revision: 17-Jul-2002: Re-released for DXP Platform.; Publisher: Altium Limited
D14 = Diode: Default Diode; Code - JEDEC: DO-214-AB; Published: 8-Jun-2000; Revision: July-2002: Re-released for DXP Platform.; Publisher: Altium Limited
L6 = BEAD_600R_350MA_0603: Bead,600R,350mA,0603,FCM1608KF-601T03,Tai-tech; Manuf_2: TDK; Manuf_Part_2: MPZ1608S300A; Value: 100uH; Comment_1: bead,30R,5A,0603,MPZ1608S300A,TDK; Revision: July-2002: Re-released for DXP Platform.; Manuf_Part_1: FCM1608KF-601T03; Order: FCM1608KF-601T03; Manuf_1: Tai-tech
LD1-LD4 = LED2: as LD10 on sheet Power; Published: 8-Jun-2000; Revision: July-2002: Re-released for DXP Platform.; Publisher: Altium Limited
R159 R293 R294 R296 = Res1: Resistor; Value: 1K; Ordered by: Subcon; Published: 8-Jun-2000; Revision: July-2002: Re-released for DXP Platform.; Publisher: Altium Limited
R163 = res1: Resistor; Value: 1K; Ordered by: Subcon; Published: 8-Jun-2000; Revision: July-2002: Re-released for DXP Platform.; Publisher: Altium Limited
R167 R176 R177 = Resistor_ST: as R148 on sheet ST_LINK_V2-1
R169 = Resistor_ST: as R155 on sheet ST_LINK_V2-1; Value: 10K
R171 R182 R213-R216 = Res1: Resistor; Value: 1K; Published: 8-Jun-2000; Revision: July-2002: Re-released for DXP Platform.; Publisher: Altium Limited
TP22-TP25 = TP
U22 = MFX: Multifunction expander